# EAGLE board Raspberry_Pi_Circuit_Board (EAGLE 9.6.2), part 1 of 2
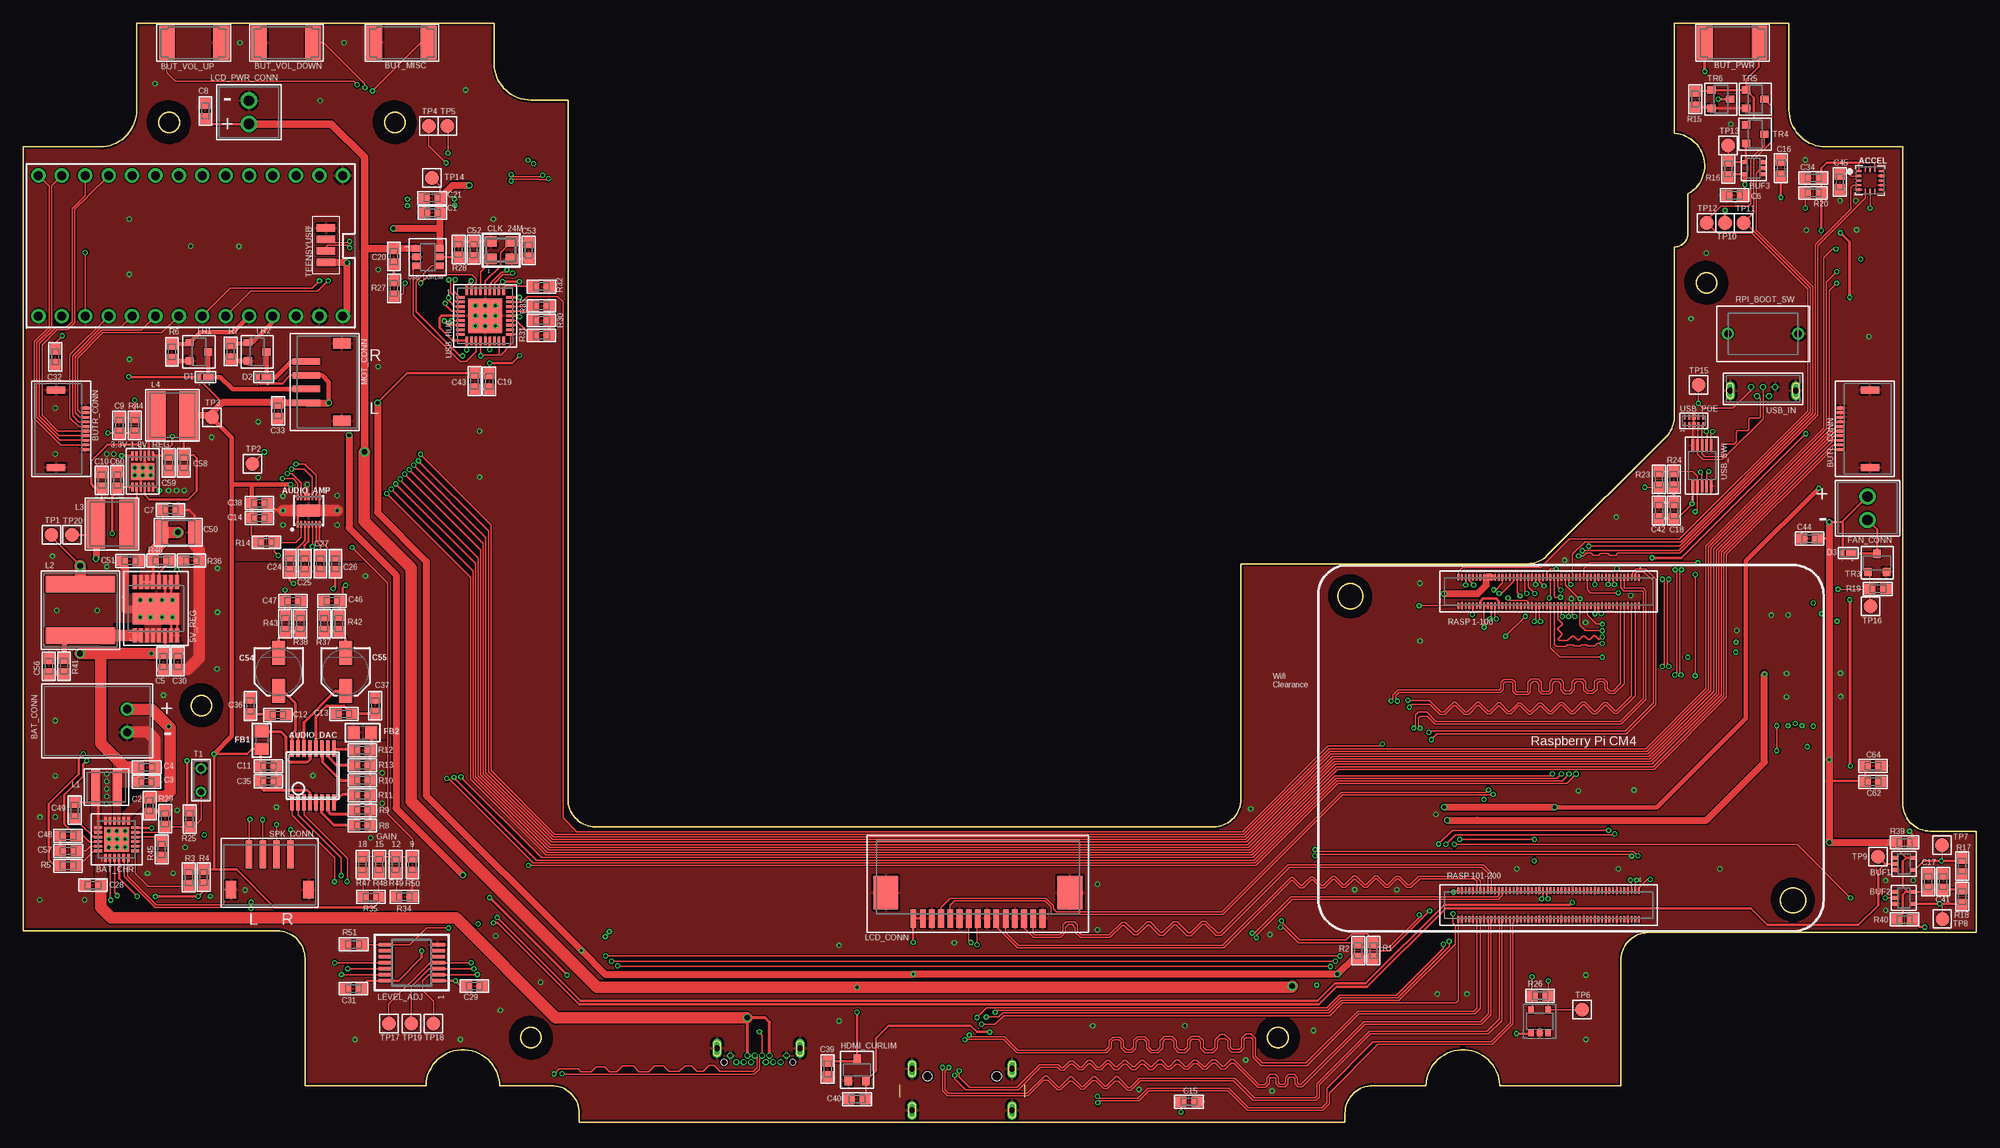
[diagram p15: board, top side]
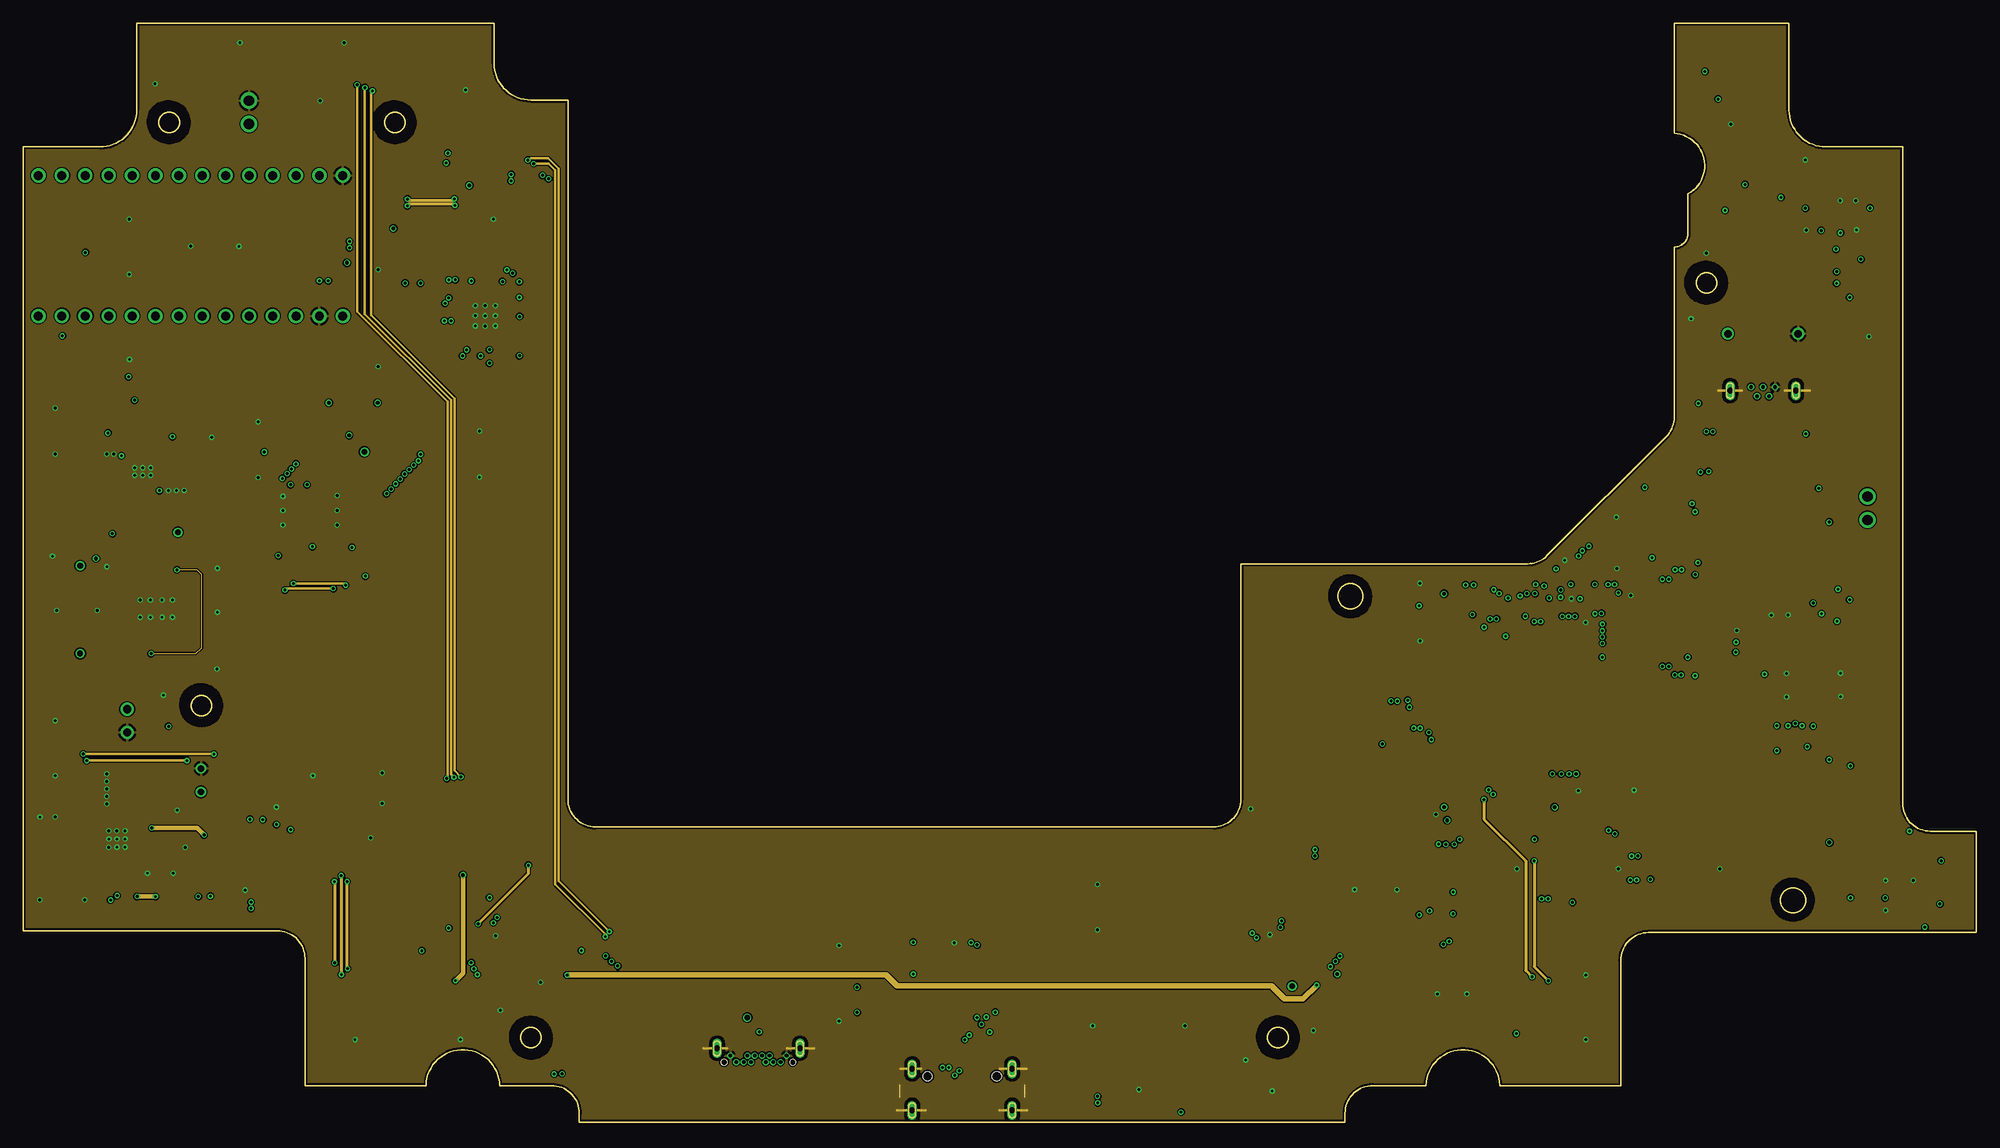
[diagram p16: board, inner layer Route2]
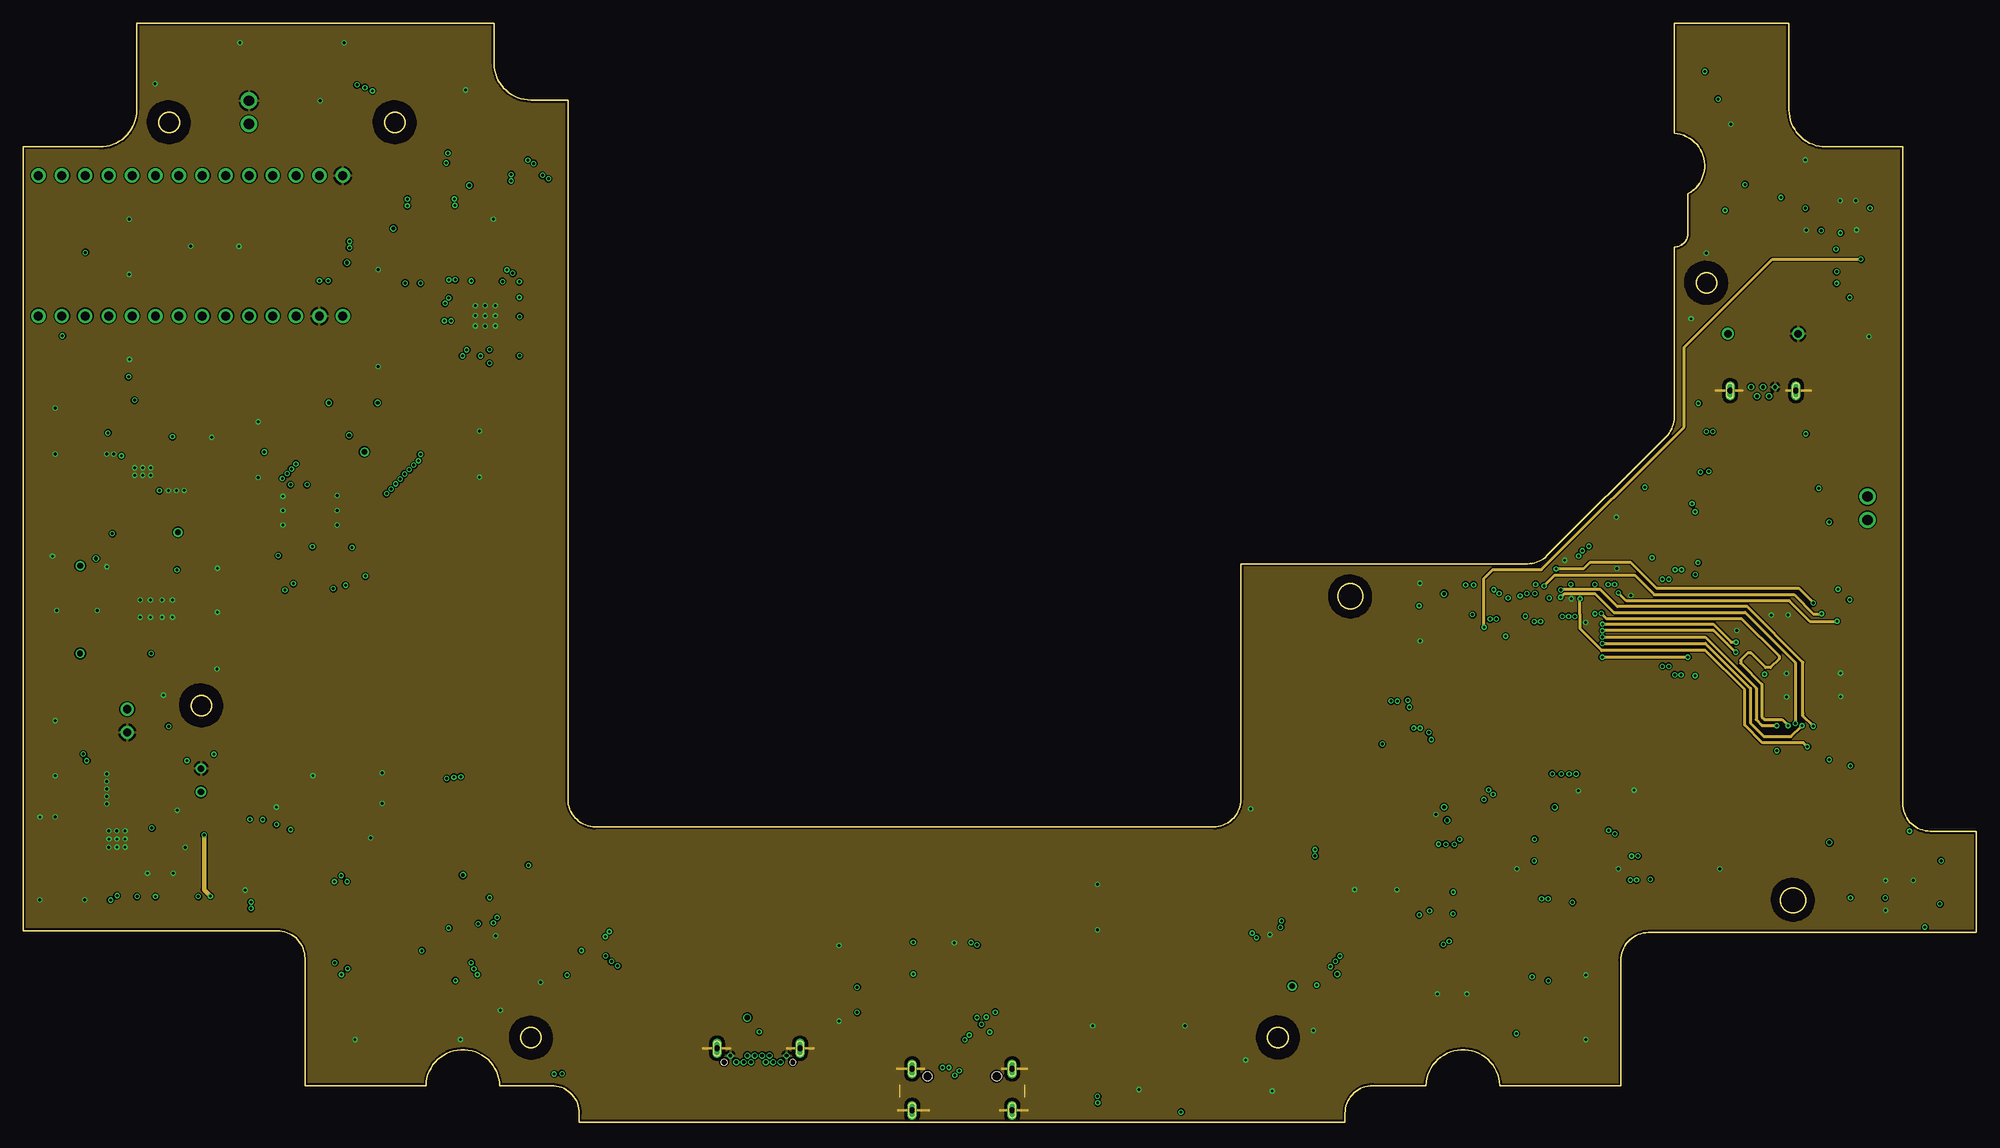
[diagram p17: board, inner layer Route15]
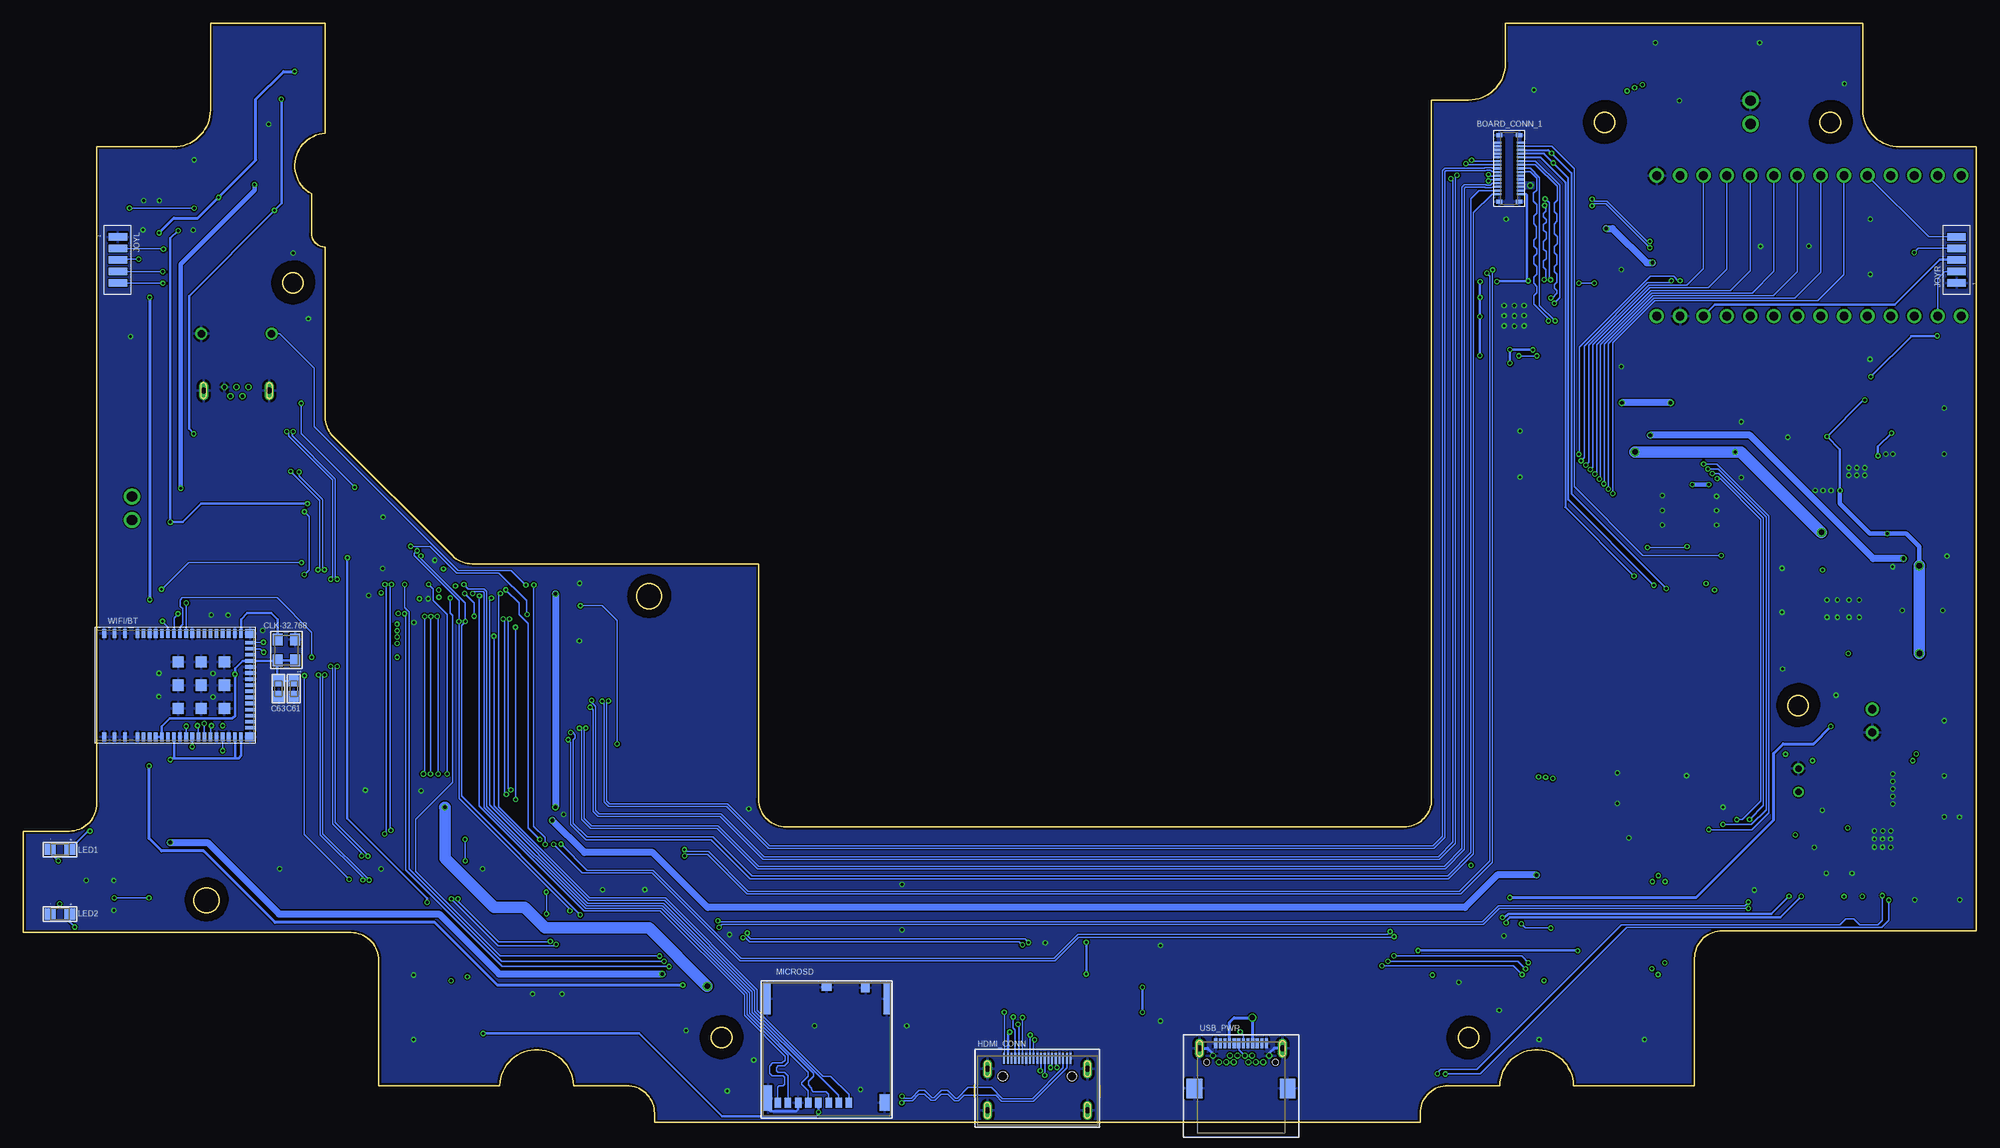
[diagram p18: board, bottom side, seen from below]

Size 211.85 x 119.26 mm. Coordinates in mm from the lower left corner, seen from the top.
Outline: 178.2,74.4 165.28,61.48 arc-45 163.15,60.6 132.09,60.6 132.09,35.07 arc-90 129.09,32.07 62.09,32.07 arc-90 59.09,35.07 59.09,110.9 55.08,110.9 arc-90 51.08,114.9 51.08,119.26 12.33,119.26 12.33,109.83 arc-90 8.33,105.83 0,105.83 0,20.8 27.57,20.8 arc-90 30.57,17.8 30.57,4 43.7,4 arc-177 51.69,4 57.33,4 arc-90 60.33,1 60.33,0 143.38,0 143.38,1 arc-90 146.38,4 152.16,4 arc-177 160.15,4 173.28,4 173.28,17.6 arc-90 176.28,20.6 211.85,20.6 211.85,31.6 206.85,31.6 arc-90 203.85,34.6 203.85,105.83 195.53,105.83 arc-90 191.53,109.83 191.53,119.26 179.08,119.26 179.08,107.29 arc-148 180.58,100.74 180.58,96.46 arc-90 179.08,94.96 179.08,76.52 arc-45 178.2,74.4
Outline: circle at 182.57,91.07 radius 1.1
Outline: circle at 143.95,57.1 radius 1.35
Outline: circle at 55.09,9.23 radius 1.1
Outline: circle at 136.09,9.23 radius 1.1
Outline: circle at 191.95,24.1 radius 1.35
Outline: circle at 40.34,108.47 radius 1.1
Outline: circle at 19.35,45.22 radius 1.1
Outline: circle at 15.86,108.47 radius 1.1
Copper layers (1+2*15+16): Top 0.035mm / dielectric 1.6mm / Route2 0.035mm / dielectric 0.15mm / Route15 0.035mm / dielectric 0.2mm / Bottom 0.035mm
Design rules "default2 *": minimum track width 5mil, minimum drill 0.3mm, track to track 5mil, track to pad 5mil, pad to pad 5mil, via to via 5mil, smd to smd 5mil, copper to edge 0.2mm, drill to drill 6mil, minimum pad ring 0.13mm, minimum via ring 0.13mm, stop-mask expansion 4mil, vias tented up to drill 0mil, thermal gap 10mil
Net classes: 1 PWR 1A: width 0.254 mm; 2 PWR 2A: width 0.762 mm; 3 PWR 3A: width 1.27 mm; 4 PWR 4A: width 2.032 mm
Milling: 50 lines

## Footprints (pad centres in the part's own frame; a part is rotated, then mirrored left to right if it is on the bottom)
IC-PAM2306 = smd 1 x 0.25: EN1 -1.7,-1.125; EN2 1.7,1.125; FB1 -1.7,-0.225; FB2 1.7,0.225; GND1 -1.7,0.225; GND2 1.7,-0.225; LX1 1.7,-0.675; LX2 -1.7,0.675; NC1 -1.7,-0.675; NC2 1.7,0.675; VIN1 1.7,-1.125; VIN2 -1.7,1.125 | smd 1.7 x 2.5: PWRPAD 0,0
IC-TPS61032 = smd 1.5 x 0.45: EN 2.875,-2.275; FB 2.875,-0.325; GND 2.875,-0.975; LBI -2.925,-1.625; LBO 2.875,-1.625; NC 2.875,2.275; PGND1 -2.925,0.975; PGND2 -2.925,0.325; PGND3 -2.925,-0.325; SW1 -2.925,2.275; SW2 -2.925,1.625; SYNC -2.925,-2.275; VBAT -2.925,-0.975; VOUT1 2.875,1.625; VOUT2 2.875,0.975; VOUT3 2.875,0.325 | smd 3.4 x 5: PWRPAD 0,0
MMA845X_QFN_16MM = smd 0.65 x 0.25: 1 -1.216,1; 2 -1.216,0.5; 3 -1.216,0; 4 -1.216,-0.5; 5 -1.216,-1; 9 1.216,-1; 10 1.216,-0.5; 11 1.216,0; 12 1.216,0.5; 13 1.216,1 | smd 0.25 x 0.65: 6 -0.5,-1.216; 7 0,-1.216; 8 0.5,-1.216; 14 0.5,1.216; 15 0,1.216; 16 -0.5,1.216
TDFN14_3X3MM = smd 0.7 x 0.2: P$1 -1.475,1.2; P$2 -1.475,0.8; P$3 -1.475,0.4; P$4 -1.475,0; P$5 -1.475,-0.4; P$6 -1.475,-0.8; P$7 -1.475,-1.2; P$8 1.475,-1.2; P$9 1.475,-0.8; P$10 1.475,-0.4; P$11 1.475,0; P$12 1.475,0.4; P$13 1.475,0.8; P$14 1.475,1.2 | smd 1.27 x 2.35: P$THERMAL 0,0
SSOP16_4.4MM = smd 0.4 x 1.75: 1 -2.275,-2.92; 2 -1.625,-2.92; 3 -0.975,-2.92; 4 -0.325,-2.92; 5 0.325,-2.92; 6 0.975,-2.92; 7 1.625,-2.92; 8 2.275,-2.92; 9 2.275,2.92; 10 1.625,2.92; 11 0.975,2.92; 12 0.325,2.92; 13 -0.325,2.92; 14 -0.975,2.92; 15 -1.625,2.92; 16 -2.275,2.92
IC-BQ25895 = smd 0.28 x 0.85: /CE -0.25,-2; /QON 1.25,-2; BTST 0.25,2; DSEL -1.25,2; ILIM 0.25,-2; INT -1.25,-2; OTG -0.75,-2; PMID -0.75,2; REGN -0.25,2; SW1 1.25,2; SW2 0.75,2; TS 0.75,-2 | smd 0.85 x 0.28: BAT1 2,-1.25; BAT2 2,-0.75; D+ -2,0.75; D- -2,0.25; PGND1 2,0.75; PGND2 2,1.25; SCL -2,-0.75; SDA -2,-1.25; STAT -2,-0.25; SYS1 2,-0.25; SYS2 2,0.25; VBUS -2,1.25 | smd 2.7 x 2.7: PWRPAD 0,0
CONN-S2B-XH-A = drill 0.9: 1 1.25,0; 2 -1.25,0
MEZZANINE-AXT630124 = smd 0.23 x 0.75: 1 2.8,1.225; 2 2.4,1.225; 3 2,1.225; 4 1.6,1.225; 5 1.2,1.225; 6 0.8,1.225; 7 0.4,1.225; 8 0,1.225; 9 -0.4,1.225; 10 -0.8,1.225; 11 -1.2,1.225; 12 -1.6,1.225; 13 -2,1.225; 14 -2.4,1.225; 15 -2.8,1.225; 16 2.8,-1.225; 17 2.4,-1.225; 18 2,-1.225; 19 1.6,-1.225; 20 1.2,-1.225; 21 0.8,-1.225; 22 0.4,-1.225; 23 0,-1.225; 24 -0.4,-1.225; 25 -0.8,-1.225; 26 -1.2,-1.225; 27 -1.6,-1.225; 28 -2,-1.225; 29 -2.4,-1.225; 30 -2.8,-1.225 | smd 0.45 x 0.655: MP_1 -3.6,1.077; MP_2 3.6,1.077; MP_3 -3.6,-1.077; MP_4 3.6,-1.077
BUF-74LVC1G07 = smd 0.42 x 0.6: A 0,-0.95; GND 0.65,-0.95; NC -0.65,-0.95; VCC -0.65,0.95; Y 0.65,0.95
BUT-KSS331GLFS = smd 1.7 x 3.7: 1 0,0; 2 5.9,0
CONN-FH52-10S-0.5SH = smd 0.3 x 0.85: 1 -2.25,0; 2 -1.75,0; 3 -1.25,0; 4 -0.75,0; 5 -0.25,0; 6 0.25,0; 7 0.75,0; 8 1.25,0; 9 1.75,0; 10 2.25,0 | smd 0.8 x 2: MP1 -4.2,-3.175; MP2 4.2,-3.175
CAP-603 = smd 1.2 x 1.1: A -0.85,0; C 0.85,0
CAP-TAN-1411 = smd 1.35 x 2.7: A -1.75,0; C 1.75,0
PANASONIC_C = smd 2.6 x 1.4: + 2.05,0; - -2.05,0
CLK-ECS-327 = smd 1.3 x 1.1: GND -1.15,0.95; OE 1.15,0.95; OUT -1.15,-0.95; VDD 1.15,-0.95
CLK-ECS-240 = smd 1.3 x 1.1: GND_1 -1.15,0.95; GND_2 1.15,-0.95; IN/OUT -1.15,-0.95; OUT/IN 1.15,0.95
DIODE-X3-WLB1608-2 = smd 1.035 x 0.69: A 0.293,0 | smd 0.385 x 0.69: C -0.619,0
CONN-282834-2 = drill 1.1: 1 -1.27,0; 2 1.27,0
0805@1 = smd 1.3 x 1.5: 1 -0.95,0; 2 0.95,0
HDMI-2001-1-2-21-00-BK = smd 0.23 x 1.2: 1 3.6,0; 2 3.2,0; 3 2.8,0; 4 2.4,0; 5 2,0; 6 1.6,0; 7 1.2,0; 8 0.8,0; 9 0.4,0; 10 0,0; 11 -0.4,0; 12 -0.8,0; 13 -1.2,0; 14 -1.6,0; 15 -2,0; 16 -2.4,0; 17 -2.8,0; 18 -3.2,0; 19 -3.6,0 | drill 0.65 long: MP_1 -5.425,-1.15; MP_2 -5.425,-5.65; MP_3 5.425,-1.15; MP_4 5.425,-5.65 | hole 1: -3.745,-1.95; 3.745,-1.95
CURLIM-AP2331 = smd 0.8 x 1: GND -0.954,-1.2; IN 0,1.2; OUT 0.954,-1.2
CONN_5PIN = smd 0.8 x 2: 1 -2.5,-1.29; 2 -1.25,-1.29; 3 0,-1.29; 4 1.25,-1.29; 5 2.5,-1.29
IND-74438357022 = smd 0.98 x 3.7: A -1.185,0; C 1.185,0
IND-NRS8040T6R8NJGJ = smd 1.8 x 7.5: A -2.8,0; C 2.8,0
IND-744043004 = smd 5.3 x 2: A 0,1.75; C 0,-1.75
FPC-1-84952-5 = smd 0.61 x 2: 1 7,1; 2 6,1; 3 5,1; 4 4,1; 5 3,1; 6 2,1; 7 1,1; 8 0,1; 9 -1,1; 10 -2,1; 11 -3,1; 12 -4,1; 13 -5,1; 14 -6,1; 15 -7,1 | smd 2.68 x 3.6: MP_1 -9.99,-1.8; MP_2 9.99,-1.8
LED-SM0805UWC = smd 1.2 x 1.2: A 0,1.05; C 0,-1.05
IC-TXB0104 = smd 0.35 x 1.6: A1 -1.3,-2.8; A2 -0.65,-2.8; A3 0,-2.8; A4 0.65,-2.8; B1 -1.3,2.8; B2 -0.65,2.8; B3 0,2.8; B4 0.65,2.8; GND 1.95,-2.8; NC1 1.3,-2.8; NC2 1.3,2.8; OE 1.95,2.8; VCCA -1.95,-2.8; VCCB -1.95,2.8
MICROSD-5033981892_SD = smd 0.7 x 1.1: CLK 4.4,0; CMD 2.2,0; DAT0 6.6,0; DAT1 7.7,0; DAT2 0,0; DAT3 1.1,0; VDD 3.3,0; VSS 5.5,0 | smd 0.9 x 0.93: DL -1.79,-12.45 | smd 1.05 x 0.78: DS 2.425,-12.54 | smd 1.14 x 1.8: MP_1 -3.88,0 | smd 0.86 x 2.8: MP_2 8.78,-0.5 | smd 0.7 x 3.33: MP_3 -4.1,-11.265; MP_4 8.86,-11.265
IC-RT9742 = smd 0.6 x 0.8: /FLG 0.94,-1.25; EN 0.94,1.196; GND 0,-1.25; VIN -0.94,1.196; VOUT -0.94,-1.25
CONN-VS4B-ZR-SM4A-TF = smd 0.7 x 3: 1 2.25,-1.5; 2 0.75,-1.5; 3 -0.75,-1.5; 4 -2.25,-1.5 | smd 1.1 x 1.9: MP_1 4.2,2.35; MP_2 -4.2,2.35
RES-603 = smd 1.2 x 1.1: A -0.85,0; C 0.85,0
DIP-A6TN-1104 = drill 0.8: 1 0,3.81; 2 0,-3.81
CONN-DF40_CL0594-5437-8-00_2D = smd 0.2 x 0.7: 1 9.8,1.54; 2 9.8,-1.54; 3 9.4,1.54; 4 9.4,-1.54; 5 9,1.54; 6 9,-1.54; 7 8.6,1.54; 8 8.6,-1.54; 9 8.2,1.54; 10 8.2,-1.54; 11 7.8,1.54; 12 7.8,-1.54; 13 7.4,1.54; 14 7.4,-1.54; 15 7,1.54; 16 7,-1.54; 17 6.6,1.54; 18 6.6,-1.54; 19 6.2,1.54; 20 6.2,-1.54; 21 5.8,1.54; 22 5.8,-1.54; 23 5.4,1.54; 24 5.4,-1.54; 25 5,1.54; 26 5,-1.54; 27 4.6,1.54; 28 4.6,-1.54; 29 4.2,1.54; 30 4.2,-1.54; 31 3.8,1.54; 32 3.8,-1.54; 33 3.4,1.54; 34 3.4,-1.54; 35 3,1.54; 36 3,-1.54; 37 2.6,1.54; 38 2.6,-1.54; 39 2.2,1.54; 40 2.2,-1.54; 41 1.8,1.54; 42 1.8,-1.54; 43 1.4,1.54; 44 1.4,-1.54; 45 1,1.54; 46 1,-1.54; 47 0.6,1.54; 48 0.6,-1.54; 49 0.2,1.54; 50 0.2,-1.54; 51 -0.2,1.54; 52 -0.2,-1.54; 53 -0.6,1.54; 54 -0.6,-1.54; 55 -1,1.54; 56 -1,-1.54; 57 -1.4,1.54; 58 -1.4,-1.54; 59 -1.8,1.54; 60 -1.8,-1.54; 61 -2.2,1.54; 62 -2.2,-1.54; 63 -2.6,1.54; 64 -2.6,-1.54; 65 -3,1.54; 66 -3,-1.54; 67 -3.4,1.54; 68 -3.4,-1.54; 69 -3.8,1.54; 70 -3.8,-1.54; 71 -4.2,1.54; 72 -4.2,-1.54; 73 -4.6,1.54; 74 -4.6,-1.54; 75 -5,1.54; 76 -5,-1.54; 77 -5.4,1.54; 78 -5.4,-1.54; 79 -5.8,1.54; 80 -5.8,-1.54; 81 -6.2,1.54; 82 -6.2,-1.54; 83 -6.6,1.54; 84 -6.6,-1.54; 85 -7,1.54; 86 -7,-1.54; 87 -7.4,1.54; 88 -7.4,-1.54; 89 -7.8,1.54; 90 -7.8,-1.54; 91 -8.2,1.54; 92 -8.2,-1.54; 93 -8.6,1.54; 94 -8.6,-1.54; 95 -9,1.54; 96 -9,-1.54; 97 -9.4,1.54; 98 -9.4,-1.54; 99 -9.8,1.54; 100 -9.8,-1.54
THERM-NTCLE101E3C90173 = drill 0.7: 1 -1.27,0; 2 1.27,0
TEENSY_3.0-3.2&LC_DIL = drill 0.965: 0 -7.62,13.97; 1 -7.62,11.43; 2 -7.62,8.89; 3 -7.62,6.35; 3.3V 7.62,11.43; 4 -7.62,3.81; 5 -7.62,1.27; 6 -7.62,-1.27; 7 -7.62,-3.81; 8 -7.62,-6.35; 9 -7.62,-8.89; 10 -7.62,-11.43; 11 -7.62,-13.97; 12 -7.62,-16.51; 13 7.62,-16.51; 14/A0 7.62,-13.97; 15/A1 7.62,-11.43; 16/A2 7.62,-8.89; 17/A3 7.62,-6.35; 18/A4 7.62,-3.81; 19/A5 7.62,-1.27; 20/A6 7.62,1.27; 21/A7 7.62,3.81; 22/A8 7.62,6.35; 23/A9 7.62,8.89; AGND 7.62,13.97; GND -7.62,16.51; VIN 7.62,16.51
CONN_4PIN = smd 0.8 x 2: 1 -2.5,-1.29; 2 -1.25,-1.29; 3 0,-1.29; 4 1.25,-1.29
TESTPOINT = smd 1.5 x 1.5: TP 0,0
TRAN-DMG2302UKQ = smd 0.8 x 0.9: D 0,1; G -1,-1; S 1,-1
CURLIM-AP22653W6 = smd 0.7 x 0.9: EN 0.95,-1.25; GND 0,-1.25; ILIM 0,1.25; IN -0.95,-1.25; NFAULT 0.95,1.25; OUT -0.95,1.25
USBPORT-USB2514BT-I/M2 = smd 0.9 x 0.28: 1 -2.7,2; 2 -2.7,1.5; 3 -2.7,1; 4 -2.7,0.5; 5 -2.7,0; 6 -2.7,-0.5; 7 -2.7,-1; 8 -2.7,-1.5; 9 -2.7,-2; 19 2.7,-2; 20 2.7,-1.5; 21 2.7,-1; 22 2.7,-0.5; 23 2.7,0; 24 2.7,0.5; 25 2.7,1; 26 2.7,1.5; 27 2.7,2 | smd 0.28 x 0.9: 10 -2,-2.7; 11 -1.5,-2.7; 12 -1,-2.7; 13 -0.5,-2.7; 14 0,-2.7; 15 0.5,-2.7; 16 1,-2.7; 17 1.5,-2.7; 18 2,-2.7; 28 2,2.7; 29 1.5,2.7; 30 1,2.7; 31 0.5,2.7; 32 0,2.7; 33 -0.5,2.7; 34 -1,2.7; 35 -1.5,2.7; 36 -2,2.7 | smd 3.7 x 3.7: 37 0,0
USB-USB3131-30-0230-A = drill 0.4: D+ 0,0; D- -0.65,-1; GND 1.3,0; NC 0.65,-1; VBUS -1.3,0 | drill 0.65 long: MP_1 -3.575,-0.395; MP_2 3.575,-0.395
POE_PROT-TPD4EUSB30DQAR = smd 0.565 x 0.2: D1+ -0.417,1; D1- -0.417,0.5; D2+ -0.417,-0.5; D2- -0.417,-1; NC_1 0.417,1; NC_2 0.417,0.5; NC_3 0.417,-0.5; NC_4 0.417,-1 | smd 0.565 x 0.4: GND_1 -0.417,0; GND_2 0.417,0
USBC-USB-C31-S-RA-CS1D-BK-T/R = smd 0.35 x 1.1: CC1 -0.75,1.35; D+ -0.25,1.35; D- 0.25,1.35; GND_1 -2.75,1.35; GND_2 2.75,1.35; RX2+ 2.25,1.35; RX2- 1.75,1.35; SBU1 0.75,1.35; TX1+ -2.25,1.35; TX1- -1.75,1.35; VBUS_1 -1.25,1.35; VBUS_2 1.25,1.35 | drill 0.4 pad 0.65: CC2 0.8,-0.7; D+_2 0.4,0; D-_2 -0.4,0; GND_3 3.05,0; GND_4 -3.05,0; RX1+ -2.4,-0.7; RX1- -1.6,-0.7; SBU2 -0.8,-0.7; TX2+ 2.4,-0.7; TX2- 1.6,-0.7; VBUS_3 1.2,0; VBUS_4 -1.2,0 | smd 1.7 x 2.1: MP_1 -5.05,-3.55; MP_2 5.05,-3.55 | drill 0.65 long: MP_3 4.5,0.8; MP_4 -4.5,0.8 | hole 0.65: -3.725,-0.7; 3.725,-0.7
USB_SWITCH-FSUSB42-D = smd 0.3 x 1.4: /OE -1,2.2; D+ 0,-2.2; D- 0.5,-2.2; GND 1,-2.2; HSD1+ 0.5,2.2; HSD1- 1,2.2; HSD2+ -0.5,2.2; HSD2- 0,2.2; SEL -0.5,-2.2; VCC -1,-2.2
IC-LWB5+ = smd 1 x 0.4: 1 -5.6,6.93; 2 -5.6,6.27; 3 -5.6,5.61; 4 -5.6,4.95; 5 -5.6,4.29; 6 -5.6,3.63; 7 -5.6,2.97; 8 -5.6,2.31; 9 -5.6,1.65; 10 -5.6,0.99; 11 -5.6,0.33; 12 -5.6,-0.33; 13 -5.6,-0.99; 14 -5.6,-1.65; 15 -5.6,-2.31; 16 -5.6,-2.97; 17 -5.6,-3.63; 18 -5.6,-4.29; 34 5.6,-4.29; 35 5.6,-3.63; 36 5.6,-2.97; 37 5.6,-2.31; 38 5.6,-1.65; 39 5.6,-0.99; 40 5.6,-0.33; 41 5.6,0.33; 42 5.6,0.99; 43 5.6,1.65; 44 5.6,2.31; 45 5.6,2.97; 46 5.6,3.63; 47 5.6,4.29; 48 5.6,4.95; 49 5.6,5.61; 50 5.6,6.27; 51 5.6,6.93; G3 5.62,8.28; G4 5.62,9.41; G5 5.62,10.54; G6 -5.6,10.54; G7 -5.6,9.41; G8 -5.6,8.28 | smd 0.4 x 1: 19 -4.62,-5.27; 20 -3.96,-5.27; 21 -3.3,-5.27; 22 -2.64,-5.27; 23 -1.98,-5.27; 24 -1.32,-5.27; 25 -0.66,-5.27; 26 0,-5.27; 27 0.66,-5.27; 28 1.32,-5.27; 29 1.98,-5.27; 30 2.64,-5.27; 31 3.3,-5.27; 32 3.96,-5.27; 33 4.62,-5.27 | smd 1 x 1: G1 -5.6,-5.27; G2 5.6,-5.27 | smd 1.2 x 1.2: G9 2.5,2.5; G10 2.5,0; G11 2.5,-2.5; G12 0,2.5; G13 0,0; G14 0,-2.5; G15 -2.5,2.5; G16 -2.5,0; G17 -2.5,-2.5

## Placement (x,y rotation side)
3.3V-1.8V_REG  IC-PAM2306  [IC-PAM2306]  12.98,70.62 90 top
5V_REG  IC-TP61032  [IC-TPS61032]  14.42,55.75 90 top
ACCEL  MMA8451  [MMA845X_QFN_16MM]  200.31,102.18 0 top
AUDIO_AMP  MAX98306ETD+T  [TDFN14_3X3MM]  30.98,66.38 90 top
AUDIO_DAC  UDA1334ATS  [SSOP16_4.4MM]  31.44,37.62 0 top
BAT_CHR  IC-BQ25895  [IC-BQ25895]  10.17,30.72 90 top
BAT_CONN  CONN-S2B-XH-A  [CONN-S2B-XH-A]  11.29,43.57 90 top
BOARD_CONN_1  MEZZANINE-AXT630124  [MEZZANINE-AXT630124]  50.67,103.49 270 bottom
BUF1  BUF-74LVC1G07  [BUF-74LVC1G07]  203.99,28.05 270 top
BUF2  BUF-74LVC1G07  [BUF-74LVC1G07]  203.97,24.36 270 top
BUF3  BUF-74LVC1G07  [BUF-74LVC1G07]  187.69,103.52 90 top
BUT_MISC  BUT-KSS331GLFS  [BUT-KSS331GLFS]  38.08,117.13 0 top
BUT_PWR  BUT-KSS331GLFS  [BUT-KSS331GLFS]  182.41,117.13 0 top
BUT_VOL_DOWN  BUT-KSS331GLFS  [BUT-KSS331GLFS]  25.57,117.13 0 top
BUT_VOL_UP  BUT-KSS331GLFS  [BUT-KSS331GLFS]  21.49,117.13 180 top
BUTL_CONN  CONN-FH52-10S-0.5SH  [CONN-FH52-10S-0.5SH]  197.12,75.25 90 top
BUTR_CONN  CONN-FH52-10S-0.5SH  [CONN-FH52-10S-0.5SH]  6.75,75.25 270 top
C1  100uF  [CAP-603]  44.38,98.68 0 top
C2  10uF  [CAP-603]  13.73,34.38 90 top
C3  10uF  [CAP-603]  13.4,36.93 180 top
C4  10uF  [CAP-603]  13.41,38.53 180 top
C5  10uF  [CAP-603]  15.22,50.01 90 top
C6  10uF  [CAP-603]  185.6,100.57 0 top
C7  10uF  [CAP-603]  15.98,66.46 180 top
C8  10uF  [CAP-603]  19.78,109.72 270 top
C9  10uF  [CAP-603]  10.45,75.62 270 top
C10  10uF  [CAP-603]  8.55,69.68 270 top
C11  10uF  [CAP-603]  26.62,38.62 180 top
C12  10uF  [CAP-603]  27.62,44.2 180 top
C13  10uF  [CAP-603]  34.8,44.31 0 top
C14  10uF  [CAP-603]  25.62,65.56 180 top
C15  10uF  [CAP-603]  126.44,2.25 180 top
C16  10uF  [CAP-603]  190.64,103.52 270 top
C17  10uF  [CAP-603]  206.61,26.14 270 top
C18  10uF  [CAP-603]  179.04,66.39 270 top
C19  10uF  [CAP-603]  50.55,80.41 90 top
C20  10uF  [CAP-603]  40.22,93.93 90 top
C21  10uF  [CAP-603]  44.37,100.28 0 top
C24  1uF  [CAP-603]  28.94,60.62 90 top
C25  1uF  [CAP-603]  30.56,60.62 90 top
C26  1uF  [CAP-603]  33.88,60.62 90 top
C27  1uF  [CAP-603]  32.25,60.62 90 top
C28  1uF  [CAP-603]  7.59,25.75 0 top
C29  0.1uF  [CAP-603]  48.94,14.8 0 top
C30  0.1uF  [CAP-603]  16.78,50.01 90 top
C31  0.1uF  [CAP-603]  35.83,14.52 180 top
C32  0.1uF  [CAP-603]  3.49,83.06 90 top
C33  0.1uF  [CAP-603]  27.65,77.21 90 top
C34  0.1uF  [CAP-603]  194.16,102.46 0 top
C35  0.1uF  [CAP-603]  26.62,37 180 top
C36  0.1uF  [CAP-603]  24.66,45.19 270 top
C37  0.1uF  [CAP-603]  38.2,45.21 270 top
C38  0.1uF  [CAP-603]  25.62,67.19 180 top
C39  0.1uF  [CAP-603]  87.27,5.78 90 top
C40  0.1uF  [CAP-603]  90.44,2.53 0 top
C41  0.1uF  [CAP-603]  208.23,26.13 270 top
C42  0.1uF  [CAP-603]  177.42,66.38 270 top
C43  0.1uF  [CAP-603]  48.97,80.42 90 top
C44  0.1uF  [CAP-603]  193.74,63.33 0 top
C45  0.1uF  [CAP-603]  197.04,102.03 90 top
C46  0.01uF  [CAP-603]  33.5,56.56 0 top
C47  0.01uF  [CAP-603]  29.25,56.56 180 top
C48  4.7uF  [CAP-603]  4.89,31.11 0 top
C49  47nF  [CAP-603]  5.6,33.86 90 top
C50  220uF  [CAP-TAN-1411]  16.83,64.01 0 top
C51  2.2uF  [CAP-603]  11.62,60.92 0 top
C52  27pF  [CAP-603]  48.87,94.68 270 top
C53  27pF  [CAP-603]  54.84,94.62 90 top
C54  47uF  [PANASONIC_C]  27.74,48.88 270 top
C55  47uF  [PANASONIC_C]  34.97,48.88 270 top
C56  0.1uF  [CAP-603]  2.81,49.51 90 top
C57  8.2uF  [CAP-603]  4.9,29.47 180 top
C58  10uF  [CAP-603]  17.44,71.55 90 top
C59  4.7uF  [CAP-603]  15.81,71.55 90 top
C60  4.7uF  [CAP-603]  10.21,69.69 270 top
C61  0.1uF  [CAP-603]  182.49,47.05 90 bottom
C62  0.1uF  [CAP-603]  200.65,36.95 180 top
C63  10uF  [CAP-603]  184.15,47.04 90 bottom
C64  10uF  [CAP-603]  200.65,38.67 180 top
CLK-32.768  CLK-ECS-327  [CLK-ECS-327]  183.29,51.24 270 bottom
CLK_24M  CLK-ECS-240  [CLK-ECS-240]  51.84,94.63 0 top
D1  [DIODE-X3-WLB1608-2]  19.77,80.85 0 top
D2  [DIODE-X3-WLB1608-2]  26.1,80.85 0 top
D3  [DIODE-X3-WLB1608-2]  197.96,61.77 0 top
FAN_CONN  CONN-282834-2  [CONN-282834-2]  200.04,66.63 270 top
FB1  Ferrite  [0805@1]  25.88,41.46 270 top
FB2  Ferrite  [0805@1]  36.81,42.29 0 top
HDMI_CONN  HDMI-2001-1-2-21-00-BK  [HDMI-2001-1-2-21-00-BK]  101.85,6.97 0 bottom
HDMI_CURLIM  CURLIM-AP2331  [CURLIM-AP2331]  90.45,5.72 0 top
JOYL  CONN_5PIN  [CONN_5PIN]  200.28,93.56 270 bottom
JOYR  CONN_5PIN  [CONN_5PIN]  3.44,93.57 90 bottom
L1  IND-74438357022  [IND-74438357022]  9.04,36.38 0 top
L2  IND-NRS8040T6R8NJGJ  [IND-NRS8040T6R8NJGJ]  6.23,55.58 270 top
L3  IND-744043004  [IND-744043004]  9.66,64.92 270 top
L4  IND-744043004  [IND-744043004]  16.21,76.7 90 top
LCD_CONN  FPC-1-84952-5  [FPC-1-84952-5]  103.56,23.13 180 top
LCD_PWR_CONN  CONN-282834-2  [CONN-282834-2]  24.5,109.58 90 top
LED1  LED-SM0805UWC  [LED-SM0805UWC]  207.85,29.61 270 bottom
LED2  LED-SM0805UWC  [LED-SM0805UWC]  207.85,22.61 270 bottom
LEVEL_ADJ  IC-TXB0104  [IC-TXB0104]  42.15,17.34 90 top
MICROSD  MICROSD-5033981892_SD  [MICROSD-5033981892_SD]  122.29,2.15 180 bottom
MICROSD_SWI  IC-RT9742  [IC-RT9742]  164.48,11 0 top
MOT_CONN  [CONN-VS4B-ZR-SM4A-TF]  32.22,80.31 270 top
R1  10K  [RES-603]  146.45,18.64 90 top
R2  10K  [RES-603]  144.81,18.64 90 top
R3  10K  [RES-603]  17.98,26.59 270 top
R4  10K  [RES-603]  19.58,26.6 270 top
R5  10K  [RES-603]  4.88,27.86 0 top
R6  10K  [RES-603]  16.15,83.6 90 top
R7  10K  [RES-603]  22.52,83.67 90 top
R8  10K  [RES-603]  36.81,32.25 180 top
R9  10K  [RES-603]  36.81,33.88 180 top
R10  10K  [RES-603]  36.81,37.12 180 top
R11  10K  [RES-603]  36.81,35.5 180 top
R12  10K  [RES-603]  36.81,40.38 180 top
R13  10K  [RES-603]  36.81,38.75 180 top
R14  10K  [RES-603]  26.38,62.94 180 top
R15  10K  [RES-603]  181.37,111 90 top
R16  10K  [RES-603]  184.94,103.42 270 top
R17  10K  [RES-603]  210.3,27.8 270 top
R18  10K  [RES-603]  210.3,24.5 90 top
R19  10K  [RES-603]  201.15,57.89 180 top
R20  10K  [RES-603]  194.15,100.83 0 top
R23  2.2K  [RES-603]  177.41,69.75 90 top
R24  2.2K  [RES-603]  179.02,69.76 270 top
R25  5.23K  [RES-603]  18.06,32.93 90 top
R26  12K  [RES-603]  164.53,13.76 180 top
R27  12K  [RES-603]  40.24,90.47 90 top
R28  15K  [RES-603]  47.23,94.72 270 top
R29  30.1K  [RES-603]  15.4,32.94 270 top
R30  36K  [RES-603]  56.23,87.01 0 top
R31  36K  [RES-603]  56.23,85.39 0 top
R32  36K  [RES-603]  56.21,90.69 0 top
R33  36K  [RES-603]  56.22,88.58 0 top
R34  100K  [RES-603]  41.36,24.48 180 top
R35  100K  [RES-603]  37.72,24.47 0 top
R36  180K  [RES-603]  18.28,60.94 180 top
R37  220K  [RES-603]  32.65,54.12 270 top
R38  220K  [RES-603]  30.06,54.12 270 top
R39  2.2K  [RES-603]  204.04,30.38 180 top
R40  2.2K  [RES-603]  204.03,22.02 180 top
R41  47  [RES-603]  4.44,49.49 270 top
R42  100  [RES-603]  34.25,54.12 90 top
R43  100  [RES-603]  28.44,54.12 90 top
R44  100K  [RES-603]  12.12,75.63 270 top
R45  120  [RES-603]  15.02,29.63 90 top
R46  1.65M  [RES-603]  14.97,60.94 180 top
R47  0K  [RES-603]  36.82,27.99 270 top
R48  0K  [RES-603]  38.61,27.99 270 top
R49  0K  [RES-603]  40.41,27.99 270 top
R50  0K  [RES-603]  42.23,27.98 270 top
R51  50K  [RES-603]  35.86,19.3 0 top
RPI_BOOT_SW  DIP-A6TN-1104  [DIP-A6TN-1104]  188.71,85.56 90 top
RPI_PINS1-100  CONN-DF40_CL0594-5437-8-00_2D  [CONN-DF40_CL0594-5437-8-00_2D]  165.45,57.6 0 top
RPI_PINS101-200  CONN-DF40_CL0594-5437-8-00_2D  [CONN-DF40_CL0594-5437-8-00_2D]  165.45,23.6 0 top
SPK_CONN  [CONN-VS4B-ZR-SM4A-TF]  26.75,27.59 180 top
T1  10K  [THERM-NTCLE101E3C90173]  19.31,37.13 90 top
TEENSY  TEENSY_LC_DIL  [TEENSY_3.0-3.2&LC_DIL]  18.17,95.1 270 top
TEENSYUSB  CONN_4PIN  [CONN_4PIN]  34.15,94.54 270 top
TP1  TESTPOINT  [TESTPOINT]  3.1,63.74 0 top
TP2  TESTPOINT  [TESTPOINT]  24.9,71.47 0 top
TP3  TESTPOINT  [TESTPOINT]  20.47,76.48 0 top
TP4  TESTPOINT  [TESTPOINT]  44,108.1 0 top
TP5  TESTPOINT  [TESTPOINT]  46,108.1 0 top
TP6  TESTPOINT  [TESTPOINT]  169.07,12.24 0 top
TP7  TESTPOINT  [TESTPOINT]  208.12,30.11 0 top
TP8  TESTPOINT  [TESTPOINT]  208.15,22.09 0 top
TP9  TESTPOINT  [TESTPOINT]  201.18,28.82 0 top
TP10  TESTPOINT  [TESTPOINT]  184.6,97.6 0 top
TP11  TESTPOINT  [TESTPOINT]  186.6,97.6 0 top
TP12  TESTPOINT  [TESTPOINT]  182.6,97.6 0 top
TP13  TESTPOINT  [TESTPOINT]  184.9,106 0 top
TP14  TESTPOINT  [TESTPOINT]  44.34,102.45 0 top
TP15  TESTPOINT  [TESTPOINT]  181.71,80.02 0 top
TP16  TESTPOINT  [TESTPOINT]  200.36,55.99 0 top
TP17  TESTPOINT  [TESTPOINT]  39.67,10.72 0 top
TP18  TESTPOINT  [TESTPOINT]  44.52,10.72 0 top
TP19  TESTPOINT  [TESTPOINT]  42.11,10.72 0 top
TP20  TESTPOINT  [TESTPOINT]  5.32,63.73 0 top
TR1  [TRAN-DMG2302UKQ]  19.08,83.6 270 top
TR2  [TRAN-DMG2302UKQ]  25.4,83.6 270 top
TR3  [TRAN-DMG2302UKQ]  201.08,60.7 0 top
TR4  [TRAN-DMG2302UKQ]  187.85,107.2 270 top
TR5  [TRAN-DMG2302UKQ]  187.87,111 270 top
TR6  [TRAN-DMG2302UKQ]  184.12,111 270 top
USB_CURLIM  CURLIM-AP22653W6  [CURLIM-AP22653W6]  43.89,93.88 270 top
USB_HUB  USBPORT-USB2514BT-I/M2  [USBPORT-USB2514BT-I/M2]  50.12,87.5 0 top
USB_IN  USB-USB3131-30-0230-A  [USB-USB3131-30-0230-A]  188.71,79.78 0 top
USB_POE  POE_PROT-TPD4EUSB30DQAR  [POE_PROT-TPD4EUSB30DQAR]  181.19,76.11 90 top
USB_PWR  USBC-USB-C31-S-RA-CS1D-BK-T/R  [USBC-USB-C31-S-RA-CS1D-BK-T/R]  79.75,7.25 0 bottom
USB_SWI  USB_SWITCH-FSUSB42-D  [USB_SWITCH-FSUSB42-D]  182.08,71.25 0 top
WIFI/BT  IC-LWB5+  [IC-LWB5+]  192.51,47.43 90 bottom

## Tracks (layer width: path | path; a pad name or v marks a point on that pad's centre or on a via)
AGND  (via drill 0.3)
  Top 0.254: AUDIO_DAC.15 29.81,42.13
  Bottom 0.203: BOARD_CONN_1.11 47.3,104.69 44.59,101.99 44.59,66.74 v37.13,59.28
  pour Top: 23.02,60.65 37.22,60.65 39.49,58.38 39.49,41.74 39.4,41.66 23.08,41.66 23.04,41.69 23.04,60.61
AUDSD  (via drill 0.3)
  Top 0.152: AUDIO_AMP.P$2 30.18,63.53 29.58,62.93 R14.A | R14.A | v27.68,61.49 27.23,61.95 R14.A
  Bottom 0.152: BOARD_CONN_1.14 46.04,105.89 43.63,103.48 43.63,68.96 36.16,61.49 v27.68,61.49
BAT  (via drill 0.3)
  Top 0.254: C16.C v190.64,100.36 v190.65,100.35
  Top 0.305: v59,16 v50.6,24.4 | v198.1,56.7 198.19,56.62 v198.19,38.69 | v198.1,89.5 198.1,95.5 v197.1,96.5 | v182.4,114 BUT_PWR.1
  Top 1.27: C2.C 13.86,35.36 13.86,35.35 15.42,35.35 15.94,35.87 15.94,42.82 v15.79,42.97 13.93,44.82 BAT_CONN.1
  Route2 0.61: v59,16 93.6,16 94.8,14.8 135.4,14.8 136.8,13.4 138.8,13.4 v140.3,14.9
  Bottom 0.305: v15.79,42.97 17.67,41.09 20.96,41.09 22,40.05 22,32.8 30.4,24.4 v50.6,24.4 | v140.3,14.9 160.4,14.9 167.2,21.7 184.53,21.7 192.28,29.44 196.82,29.44 198.19,30.8 v198.19,38.69 | v198.1,89.5 v198.1,56.7 | v197.1,96.5 195.5,98.1 192.9,98.1 v190.65,100.35 186.6,104.4 186.6,111 183.6,114 v182.4,114
  pour Top (no thermals): 10.93,32.36 10.93,33.66 13.19,35.91 14.01,35.91 14.21,35.72 14.21,34.84 14.16,34.8 13.32,34.8 11.67,33.15 11.62,33.09 11.62,32.36
BITCLK_IN  (via drill 0.3)
  Top 0.152: RPI_PINS1-100.49 165.65,57.2 165.52,57.07 v165.52,56.89 | v142.81,18.05 v142.8,18.05 63.2,18.05 v63.18,18.07 | TP17.TP 39.67,12.87 44.14,17.34 LEVEL_ADJ.A3 v48.6,17.34
  Bottom 0.152: v142.81,18.05 v142.82,18.06 160.09,18.06 169.25,27.22 169.25,32.9 165.25,36.91 165.25,55.02 165.52,55.29 v165.52,56.89 | v63.18,18.07 63.17,18.05 49.31,18.05 v48.6,17.34
BT_REG_ON  (via drill 0.3)
  Top 0.152: RPI_PINS1-100.34 168.85,53.96 169.46,53.35 v171.29,53.35
  Route15 0.305: v171.29,53.35 183.34,53.35 185.68,51.02 v185.75,51.02
  Bottom 0.152: WIFI/BT.32 187.19,51.34 186.14,51.34 185.82,51.02 v185.75,51.02
BT_UART_CTS  (via drill 0.3)
  Top 0.152: RPI_PINS1-100.29 169.65,57.8 170,57.45 v173.01,57.45 v173.02,57.45
  Route15 0.305: v173.02,57.45 173.89,56.58 191.57,56.58 193.78,54.36 v196.73,54.36 v196.74,54.37
  Bottom 0.152: v196.74,54.37 196.14,53.77 WIFI/BT.46
BT_UART_RTS  (via drill 0.3)
  Top 0.152: RPI_PINS1-100.50 165.65,51.48 166.65,50.48 v171.27,50.48
  Route15 0.305: v171.27,50.48 v180.55,50.48
  Bottom 0.152: v180.55,50.48 180.55,53.18 184.3,56.93 194.56,56.93 194.79,56.7 194.79,55.99 194.55,55.76 194.55,54.02 194.82,53.76 WIFI/BT.44
BT_UART_RXD  (via drill 0.3)
  Top 0.152: RPI_PINS1-100.51 165.25,59.68 165.62,60.05 v166.26,60.05
  Route15 0.305: v166.26,60.05 169.24,60.05 169.94,60.75 174.35,60.75 177.16,57.94 192.63,57.94 194.15,56.42 v194.15,56.34
  Bottom 0.152: v194.15,56.34 v194.16,56.33 WIFI/BT.43
BT_UART_TXD  (via drill 0.3)
  Top 0.152: RPI_PINS1-100.55 164.45,58.71 v164.96,58.2
  Route15 0.305: v164.96,58.2 166.12,59.37 174.78,59.37 176.91,57.25 192.09,57.25 194.16,55.19 v195.04,55.19
  Bottom 0.152: v195.04,55.19 195.48,54.75 WIFI/BT.45
D+  (via drill 0.3)
  Top 0.152: v9.5,24.12 9.44,24.19 9.44,28.7 BAT_CHR.D+ | USB_PWR.D+_2 79.59,7.01 79.59,5.91 79.22,5.54 75.58,5.54 74.93,6.19 74.41,6.19 73.77,5.54 73.11,5.54 72.48,6.17 71.8,6.17 71.16,5.54 70.08,5.54 69.46,6.16 68.47,6.16 67.83,5.51 66.84,5.51 66.21,6.14 65.01,6.14 64.37,5.5 63.6,5.5 63.05,6.05 62.14,6.05 61.6,5.51 60.54,5.51 60.24,5.81 58.16,5.81 v57.6,5.25
  Bottom 0.152: v9.5,24.12 9.5,21.92 10.26,21.16 37.89,21.16 53.77,5.27 57.58,5.27 v57.6,5.25 | USB_PWR.D+ 80,7.9 USB_PWR.D+_2
D+1  (via drill 0.3)
  Top 0.152: USB_HUB.4 46.5,88 45.79,88.71 45.79,88.85 v45.77,88.86
  Bottom 0.152: v45.77,88.86 45.77,88.89 45.19,89.47 45.19,101.66 47.83,104.29 BOARD_CONN_1.10
D+2  (via drill 0.3)
  Top 0.152: USB_HUB.7 46.64,86.5 46.62,86.48 46.18,86.48 v45.7,86.96
  Bottom 0.152: BOARD_CONN_1.8 48.37,103.49 47.38,102.51 47.38,88.61 45.73,86.96 v45.7,86.96
D-  (via drill 0.3)
  Top 0.152: BAT_CHR.D- 9.93,28.71 9.93,24.88 v10.21,24.6 | v79.86,9.82 80.16,9.53 USB_PWR.D-_2 79.87,6.97 79.87,5.8 79.3,5.22 58.52,5.22 v58.45,5.29
  Bottom 0.152: v10.21,24.6 10.21,21.93 10.68,21.46 12.65,21.46 13.28,22.09 14.18,22.09 14.83,21.44 38.53,21.44 54.18,5.79 58.07,5.79 58.45,5.41 v58.45,5.29 | USB_PWR.D- 79.5,9.47 v79.86,9.82
D-1  (via drill 0.3)
  Top 0.152: USB_HUB.3 46.83,88.5 46.13,89.19 46.13,89.42 v46.16,89.44
  Bottom 0.152: BOARD_CONN_1.9 49.43,103.9 47.83,103.9 45.47,101.55 45.47,100.06 45.79,99.74 45.79,98.81 45.49,98.51 45.49,97.75 45.8,97.44 45.8,96.41 45.47,96.08 45.47,95.32 45.79,95 45.79,94.37 45.5,94.08 45.5,93.13 45.78,92.85 45.78,92.28 45.51,92.01 45.51,91.13 45.76,90.89 45.76,90.51 45.49,90.24 45.49,89.94 46,89.44 v46.16,89.44
D-2  (via drill 0.3)
  Top 0.152: USB_HUB.6 47.41,87 47.4,87.01 46.47,87.01 v46.42,86.96
  Bottom 0.152: BOARD_CONN_1.7 49.43,103.11 48.38,103.11 47.7,102.43 47.7,101.14 48.04,100.81 48.04,99.92 47.7,99.58 47.7,98.66 48.02,98.34 48.02,97.48 47.7,97.16 47.7,96.01 48,95.71 48,95.08 47.66,94.74 47.66,94.25 48.01,93.9 48.01,93.16 47.69,92.83 47.69,92.01 48,91.69 48,91.03 47.67,90.69 47.67,90.02 47.98,89.71 47.98,88.75 46.42,87.19 v46.42,86.96
DATA_IN  (via drill 0.3)
  Top 0.152: RPI_PINS1-100.25 170.45,58.38 v170.46,58.37 | v142.33,17.49 v142.33,17.48 v63.82,17.48 | TP19.TP 42.1,10.73 42.1,14.72 44.06,16.69 LEVEL_ADJ.A2 44.96,16.68 48.88,16.68 v48.9,16.66
  Bottom 0.152: v142.33,17.49 159.97,17.49 170,27.52 170,55.39 170.46,55.86 v170.46,58.37 | v142.33,17.49 | v63.82,17.48 49.71,17.48 v48.9,16.66
DEEM/CLKOUT
  Top 0.305: AUDIO_DAC.9 35.79,40.55 R12.C
DSEL
  Top 0.152: BAT_CHR.DSEL 7.66,29.47 6.05,27.86 R5.C
DSI1_C_N
  Top 0.152: RPI_PINS101-200.87 158.05,26.2 157.53,26.72 151.35,26.72 150.4,25.77 150.2,25.77 149.25,26.71 148.9,26.71 147.98,25.79 147.85,25.79 146.91,26.73 146.6,26.73 145.64,25.77 145.54,25.77 144.57,26.74 144.29,26.74 143.31,25.76 143.22,25.76 142.26,26.71 142,26.71 141.03,25.74 140.82,25.74 139.92,26.65 139.66,26.65 138.72,25.71 138.59,25.71 137.71,26.59 137.48,26.59 130.1,19.21 107.97,19.21 106.53,20.64 106.53,22.11 LCD_CONN.11
DSI1_C_P
  Top 0.152: RPI_PINS101-200.89 157.65,26.2 157.4,26.44 151.47,26.44 150.51,25.49 150.08,25.49 149.14,26.43 149.02,26.43 148.09,25.51 147.73,25.51 146.83,26.41 146.68,26.41 145.75,25.49 145.42,25.49 144.51,26.4 144.34,26.4 143.43,25.48 143.1,25.48 142.21,26.37 142.06,26.37 141.15,25.46 140.71,25.46 139.87,26.3 139.71,26.3 138.84,25.43 138.48,25.43 137.66,26.25 137.54,26.25 130.21,18.93 107.84,18.93 105.56,21.21 LCD_CONN.10
DSI1_D0_N  (via drill 0.3)
  Top 0.152: RPI_PINS101-200.75 160.45,24.63 160.02,24.2 137.65,24.2 133.78,20.32 v133.78,20.05 | LCD_CONN.8 103.47,22.04 v103.47,19.27
  Bottom 0.152: v103.47,19.27 103.82,19.62 133.07,19.62 133.49,20.05 v133.78,20.05
DSI1_D0_P  (via drill 0.3)
  Top 0.152: LCD_CONN.7 102.56,19.76 v102.81,19.51 | RPI_PINS101-200.77 160.05,24.62 159.9,24.48 137.5,24.48 133.53,20.5 133.51,20.51 133.32,20.51 v133.3,20.54
  Bottom 0.152: v102.81,19.51 103.2,19.9 132.95,19.9 133.29,20.24 133.29,20.25 133.32,20.28 133.32,20.51 v133.3,20.54
DSI1_D1_N
  Top 0.152: RPI_PINS101-200.81 159.25,27.05 158.36,27.95 137.19,27.95 129.82,20.58 129.51,20.58 128.26,21.83 127.84,21.83 126.59,20.59 126.41,20.59 125.21,21.79 124.75,21.79 123.58,20.63 123.38,20.63 122.25,21.76 121.88,21.76 120.78,20.67 120.62,20.67 119.56,21.73 119.16,21.73 117.77,20.34 114.8,20.34 114.38,20.76 114.38,21.45 114.07,21.76 113.1,21.76 112.8,21.46 112.8,20.74 112.42,20.36 109.71,20.36 109.53,20.55 109.53,22.1 LCD_CONN.14
DSI1_D1_P
  Top 0.152: RPI_PINS101-200.83 158.85,27.06 158.24,27.67 137.32,27.67 129.95,20.3 129.4,20.3 128.18,21.51 127.92,21.51 126.67,20.26 126.25,20.26 125.06,21.44 124.82,21.44 123.68,20.3 123.25,20.3 122.11,21.43 121.97,21.43 120.88,20.34 120.49,20.34 119.42,21.4 119.22,21.4 117.88,20.06 114.68,20.06 114.1,20.64 114.1,21.13 113.75,21.48 113.41,21.48 113.08,21.15 113.08,20.62 112.54,20.08 112.32,20.08 112.31,20.07 111.4,20.07 111.39,20.08 109.59,20.08 108.56,21.11 LCD_CONN.13
ETH0_N  (via drill 0.3)
  Top 0.152: RPI_PINS1-100.10 173.63,56.04 173.63,55.94 173.64,55.92 173.64,47.6 172.58,46.53 172.01,46.53 171.56,46.98 171.56,47.64 171.34,47.86 170.97,47.86 170.71,47.6 170.71,46.96 170.27,46.52 169.64,46.52 169.22,46.94 169.22,47.56 168.93,47.85 168.54,47.85 168.26,47.57 168.26,46.95 167.82,46.51 167.18,46.51 166.79,46.9 166.79,47.57 166.52,47.84 166.13,47.84 165.85,47.56 165.85,46.8 165.54,46.49 164.73,46.49 164.4,46.82 164.4,47.53 164.1,47.83 163.79,47.83 163.49,47.53 163.49,46.69 163.21,46.42 161.89,46.42 161.56,46.75 161.56,47.66 161.42,47.8 160.74,47.8 160.55,47.61 160.55,46.98 160.22,46.65 149.2,46.65 148.88,46.33 148.88,45.88 v149.05,45.71
  Bottom 0.152: BOARD_CONN_1.22 51.95,103.14 52.52,103.14 52.69,103.32 53.17,103.32 53.25,103.24 57.55,103.24 57.65,103.14 57.65,30.92 58.84,29.73 131.01,29.73 135.56,34.29 148.36,34.29 148.84,34.76 148.84,45.5 v149.05,45.71
ETH0_P  (via drill 0.3)
  Top 0.152: RPI_PINS1-100.12 173.25,47.6 172.46,46.81 172.13,46.81 171.84,47.1 171.84,47.75 171.46,48.14 170.74,48.14 170.43,47.82 170.43,47.08 170.15,46.8 169.76,46.8 169.5,47.06 169.5,47.8 169.18,48.13 168.29,48.13 167.98,47.81 167.98,47.07 167.7,46.79 167.3,46.79 167.07,47.02 167.07,47.8 166.76,48.12 165.88,48.12 165.57,47.8 165.57,46.92 165.42,46.77 164.85,46.77 164.68,46.94 164.68,47.77 164.35,48.11 163.52,48.11 163.21,47.79 163.21,46.84 163.07,46.7 162.02,46.7 161.84,46.88 161.84,47.77 161.54,48.08 160.62,48.08 160.27,47.72 160.27,47.1 160.1,46.93 149.09,46.93 148.55,46.39 148.55,45.9 v148.37,45.72 v148.36,45.72
  Bottom 0.152: BOARD_CONN_1.23 51.93,103.49 51.95,103.52 52.5,103.52 52.58,103.6 53.29,103.6 53.37,103.52 57.67,103.52 57.93,103.26 57.93,31.04 58.96,30.01 130.89,30.01 135.45,34.57 148.25,34.57 148.56,34.88 148.56,45.59 148.56,45.58 148.42,45.72 v148.36,45.72
ETH1_N  (via drill 0.3)
  Top 0.152: RPI_PINS1-100.6 174.45,46.27 172.81,44.63 172.7,44.63 171.77,45.56 171.47,45.56 170.5,44.59 170.39,44.59 169.37,45.61 169.08,45.61 168.05,44.59 167.97,44.59 167,45.56 166.65,45.56 165.69,44.6 165.61,44.6 164.69,45.52 164.4,45.52 163.43,44.56 163.4,44.56 162.44,45.52 162.15,45.52 161.22,44.6 161.1,44.6 160.16,45.54 159.98,45.54 159.04,44.61 158.9,44.61 157.91,45.59 157.73,45.59 156.66,44.53 156.44,44.53 155.36,45.61 155.17,45.61 154.1,44.54 153.78,44.54 152.52,45.8 v150.18,45.8 | v56.99,102.36 v56.98,102.36 56.87,102.25 55.99,102.25 55.92,102.32 53.09,102.32 52.96,102.19 52.93,102.19 v52.93,102.14
  Bottom 0.152: v150.18,45.8 v150.17,45.79 150.17,45.57 149.75,45.15 149.75,33.86 149.37,33.48 136.14,33.48 131.47,28.81 58.38,28.81 56.78,30.41 56.78,102.17 v56.98,102.37 v56.99,102.36 | BOARD_CONN_1.20 51.92,102.29 52.83,102.29 52.93,102.2 v52.93,102.14
ETH1_P  (via drill 0.3)
  Top 0.152: RPI_PINS1-100.4 174.85,46.27 172.93,44.35 172.58,44.35 171.65,45.28 171.58,45.28 170.61,44.31 170.27,44.31 169.25,45.33 169.19,45.33 168.17,44.31 167.86,44.31 166.88,45.28 166.76,45.28 165.8,44.32 165.49,44.32 164.6,45.21 164.48,45.21 163.55,44.28 163.29,44.28 162.34,45.22 162.24,45.22 161.34,44.32 160.99,44.32 160.13,45.17 160,45.17 159.16,44.33 158.79,44.33 157.89,45.22 157.75,45.22 156.78,44.25 156.32,44.25 155.35,45.22 155.18,45.22 154.22,44.26 153.67,44.26 152.55,45.38 150.65,45.38 v150.33,45.06 v150.34,45.05 | v56.35,102.75 v56.35,102.74 56.2,102.6 53.15,102.6 52.94,102.81 v52.94,102.83
  Bottom 0.152: BOARD_CONN_1.21 51.94,102.66 52.72,102.66 52.73,102.67 52.76,102.67 52.91,102.83 v52.94,102.83 | v56.35,102.75 56.5,102.61 56.5,30.3 58.26,28.53 131.59,28.53 136.26,33.2 149.49,33.2 150.03,33.74 150.03,44.76 v150.33,45.06 v150.34,45.05
ETH2_N  (via drill 0.3)
  Top 0.152: RPI_PINS1-100.9 173.66,59.13 173.66,58.01 173.72,57.95 175.72,57.95 175.99,57.68 175.99,45.88 173.36,43.24 173.27,43.24 173.26,43.23 153.14,43.23 152.31,44.07 151.57,44.07 151.32,43.82 151.32,42.97 v151.51,42.78
  Bottom 0.152: v151.51,42.78 151.3,42.56 151.3,32.89 150.29,31.88 136.57,31.88 132.21,27.52 57.61,27.52 55.51,29.62 55.51,101.35 55.42,101.44 53.31,101.44 53.24,101.38 52.61,101.38 52.51,101.47 51.92,101.47 BOARD_CONN_1.18
ETH2_P  (via drill 0.3)
  Top 0.152: RPI_PINS1-100.11 173.26,59.13 173.26,58.01 173.6,57.67 175.6,57.67 175.71,57.56 175.71,45.99 173.24,43.52 153.25,43.52 152.26,44.51 151.32,44.51 151.02,44.2 151.02,42.93 150.88,42.78 v150.82,42.78
  Bottom 0.152: BOARD_CONN_1.19 52.48,101.9 52.73,101.66 53.13,101.66 53.19,101.72 55.54,101.72 55.79,101.47 55.79,29.74 57.73,27.8 132.09,27.8 136.45,32.16 150.17,32.16 151.02,33.01 151.02,42.64 150.88,42.78 v150.82,42.78
ETH3_N  (via drill 0.3)
  Top 0.152: RPI_PINS1-100.5 174.55,59.15 174.55,59.57 174.57,59.6 174.57,59.68 174.91,60.02 175,60.02 175.01,60.03 176,60.03 177.07,58.96 177.07,45.37 173.87,42.17 153.36,42.17 152.74,41.55 v152.74,41.53
  Bottom 0.152: BOARD_CONN_1.16 51.91,100.7 52.51,100.7 54.54,98.68 54.54,29.16 57.25,26.45 133.02,26.45 137.22,30.65 150.79,30.65 152.45,32.31 152.45,41.25 v152.73,41.53 v152.74,41.53
ETH3_P  (via drill 0.3)
  Top 0.152: v152.46,42.3 152.61,42.45 173.76,42.45 176.79,45.49 176.79,58.73 175.78,59.74 175.03,59.74 174.85,59.56 RPI_PINS1-100.3
  Bottom 0.152: BOARD_CONN_1.17 52.02,101.09 53.95,101.09 54.82,100.22 54.82,29.28 57.33,26.77 132.8,26.77 136.99,30.96 150.67,30.96 152.17,32.46 152.17,41.52 151.97,41.73 151.97,42.06 152.26,42.35 152.41,42.35 v152.46,42.3
ETH_LEDG  (via drill 0.3)
  Top 0.152: RPI_PINS1-100.15 172.45,58.51 v172.6,58.36 | v154.31,30.18 | v172.65,31.31 | v172.65,31.31 172.54,31.2 155.33,31.2 v154.31,30.18
  Route2 0.254: v55.38,104.01 56.98,104.01 57.69,103.3 57.69,25.85 63.16,20.38 v63.16,20.17
  Bottom 0.152: v172.6,58.36 172.47,58.23 172.47,31.48 v172.65,31.31 | v63.16,20.17 63.23,20.1 97.39,20.1 99.94,17.54 134.09,17.54 143.65,27.09 151.22,27.09 v154.31,30.18 | BOARD_CONN_1.24 52.48,103.89 52.5,103.92 53.36,103.92 53.39,103.89 55.29,103.89 55.38,103.98 v55.38,104.01
ETH_LEDY  (via drill 0.3)
  Top 0.152: RPI_PINS1-100.17 172.05,58.52 v171.9,58.37 | v171.95,31.7 155,31.7 v153.51,30.21 v153.51,30.2
  Route2 0.254: v54.75,104.39 54.77,104.37 54.9,104.37 55.12,104.59 56.95,104.59 58.07,103.47 58.07,26.23 v63.59,20.7
  Bottom 0.152: v171.9,58.37 172.05,58.21 172.05,31.79 v171.95,31.7 | v54.75,104.39 54.65,104.29 BOARD_CONN_1.25 | v63.59,20.7 63.88,20.42 97.46,20.42 100.06,17.82 133.98,17.82 143.53,27.37 150.68,27.37 v153.51,30.2
FB
  Top 0.254: R36.C R46.A 15.82,60.72 14.74,59.65 5V_REG.FB
GAIN1  (via drill 0.3)
  Top 0.152: v31.39,62.48 AUDIO_AMP.P$5 | R47.A R48.A R49.A 40.42,28.83 R50.A 42.25,28.85 42.25,30.76 39.53,33.47 39.53,58.52 v35.68,62.37
  Bottom 0.152: v35.68,62.37 31.5,62.37 v31.39,62.48
GLOBAL_EN
  Top 0.152: RPI_PINS1-100.99 155.65,59.77 156.09,60.21 164.61,60.21 167.67,63.27 179.65,63.27 193.55,77.17 193.55,90.42 187.51,96.46 183.74,96.46 TP12.TP 182.65,97.65 182.65,97.94 184.12,99.42 187.14,99.42 187.4,99.68 187.4,104.53 188.85,105.98 TR4.D
GND  (via drill 0.3)
  Top 0.152: BAT_CHR.PWRPAD v10.17,31.62 | USB_HUB.37 49.06,88.56 v49.06,88.61 | USB_SWI./OE 181.08,75.58 USB_POE.GND_1 USB_POE.GND_2 | R50.C 42.21,27.11 R34.A
  Top 0.2: 30.53,66.38 AUDIO_AMP.P$THERMAL 31.53,66.38 32.18,67.02 AUDIO_AMP.P$8 | 30.53,66.38 29.78,65.63 AUDIO_AMP.P$1 | 30.58,66.42 30.53,66.38
  Top 0.203: 26.48,66.42 C38.A
  Top 0.254: 5V_REG.LBI 16.04,54.12 5V_REG.PWRPAD | 5V_REG.SYNC 16.69,55.19 16.14,55.75 5V_REG.PWRPAD | 5V_REG.GND 15.39,56.72 5V_REG.PWRPAD | 5V_REG.LBO 16.04,57.37 5V_REG.PWRPAD | TR5.S TR6.S 182.97,110.15 R15.A | CLK_24M.GND_2 54.74,93.68 C53.A | R12.A R13.A R10.A R11.A R9.A R8.A | C17.A C41.A | C42.A C18.A | C18.A | R28.A 48.83,95.57 C52.A 48.91,95.58 CLK_24M.GND_1 | C21.A 43.52,98.69 C1.A | C20.A 40.22,91.34 R27.C | R33.C 57.07,87.02 R30.C R31.C | C43.A C19.A | C11.A C35.A | R24.C 179.02,67.25 C18.A | C57.C C48.A | 3.3V-1.8V_REG.GND2 13.21,70.84 3.3V-1.8V_REG.PWRPAD 12.76,70.39 3.3V-1.8V_REG.GND1 | C7.A 18,66.46 18.64,65.81 18.64,64.08 C50.C
  Top 0.305: FB2.2 37.76,40.48 R12.A | 30.58,66.42 26.48,66.42
  Top 0.508: TR1.S 16.3,82.6 R6.A | TR2.S 22.73,82.6 R7.A | C2.A 13.99,33.79 R29.A
  Top 0.813: v12.7,54.81 12.7,55.32 12.35,55.67 11.07,55.67 11.07,60.22 10.83,60.46 10.83,60.86 C51.A | C38.A C14.A
  Top 1.27: C5.A C30.A 16.82,49.12 17.84,49.12 19.12,50.4 19.12,60.93 R36.A 19.13,62.16 18.58,62.71 C50.C | v28.19,66.38 AUDIO_AMP.P$THERMAL v34.06,66.38 | C3.A 14.26,36.95 C4.A 14.26,41.61 13.52,42.34 11.32,42.34 BAT_CONN.2
  Route2 0.254: 76.36,8.05 USB_PWR.MP_3 73.82,8.05 | 82.84,8.05 USB_PWR.MP_4 85.79,8.05 | 95.15,5.82 HDMI_CONN.MP_3 97.39,5.82 | 94.77,1.32 HDMI_CONN.MP_4 97.86,1.32 | 105.97,5.82 HDMI_CONN.MP_1 108.8,5.82 | 108.88,1.32 HDMI_CONN.MP_2 105.92,1.32 | 183.88,79.39 USB_IN.MP_1 186.38,79.39 | 191.06,79.39 USB_IN.MP_2 193.76,79.39
  Route15 0.254: 186.48,79.39 USB_IN.MP_1 183.6,79.39 | 191.24,79.39 USB_IN.MP_2 193.9,79.39 | 108.87,5.82 HDMI_CONN.MP_1 106.16,5.82 | 108.95,1.32 HDMI_CONN.MP_2 105.97,1.32 | 98.26,1.32 HDMI_CONN.MP_4 94.91,1.32 | 97.73,5.82 HDMI_CONN.MP_3 94.78,5.82 | 85.75,8.05 USB_PWR.MP_4 82.83,8.05 | 76.67,8.05 USB_PWR.MP_3 73.74,8.05
  Bottom 0.152: BOARD_CONN_1.30
  Bottom 0.254: MICROSD.VSS 127.79,1.41 128,1.2 130.8,1.2 131.1,1.5 131.1,2.62 MICROSD.MP_2
  Bottom 0.305: USB_PWR.MP_3 76.14,8.05 76.7,7.49 USB_PWR.GND_3 | USB_PWR.MP_4 83.38,8.05 82.81,7.47 USB_PWR.GND_4
  other vias: 9.06,34.56 9.06,35.37 9.06,36.19 9.06,37 11.06,31.62 11.06,30.75 11.06,29.87 10.19,29.87 9.31,30.75 10.19,30.75 9.06,37.81 12.7,56.69 13.83,56.69 13.83,54.81 15.08,56.69 15.08,54.81 16.2,56.69 16.2,54.81 9.31,31.63 9.3,29.86 34.06,64.81 34.06,68 28.19,64.81 28.19,67.93 51.23,88.61 50.11,88.6 49.06,87.51 51.23,87.51 50.11,87.5 49.06,86.41 51.23,86.41 50.11,86.4 185.2,108.3 34.81,117.12 198.77,99.99 205.01,26.26 23.52,117.11 32.24,110.85 14.31,112.67 48,112 11.5,98 11.5,92 23.41,95.03 3.5,77.5 3.5,72.5 11.55,82.79 3.19,61.43 25.49,69.95 25.5,76 20.47,74.33 21.08,55.36 21.08,60.13 8.05,55.55 3.65,55.55 3.5,43.58 15.23,46.35 37.7,30.88 27.47,34.21 24.1,25.2 51.76,12.17 49.5,75 49.5,70 51,98 38.5,92.5 38.5,82 88.5,11 101,19.5 116,10.5 126,10.5 169.5,9 169.5,16 162,27.5 173,27.5 151.5,58.5 151.52,52.24 149,25.25 202,26.25 202,23 184.03,27.51 172.8,65.66 198.84,96.82 47.43,9 36,9 200.19,85.23 133.13,34.01 18.18,95.06 31.44,37.62 17.6,29.84 16.3,27.04 13.5,27.04 3.49,37.61 6.7,24.14 3.5,33.14 1.8,24.14 153.4,13.94 156.6,13.94 193.28,104.41 193.38,96.81 197.07,99.99 51.26,20.25 13.84,71.01 13.84,70.21 12.99,70.21 12.99,71.01 12.12,71.01 12.12,70.21 16.64,68.56 15.77,68.56 9.84,72.51 9.09,72.51 9.09,60.29 56.13,15.2 21.02,49.19 17.48,68.57 88.5,19.2 116.53,25.83 38.95,34.63 38.96,37.92 116.54,20.91 197.12,46.2 191.26,46.17 191.26,48.69 167.2,60.99 197.11,48.74 185.86,53.38 172.85,60.1 174.37,57.16 191.43,55.04 189.6,55.03 169.47,54.25 167.9,56.82 16.71,33.87 174.72,36.05 168.67,35.99 153.22,33.41 144.42,25.25 135.22,20.38 139.95,9.97 121.03,3.58 132.59,6.77 135.48,3.42 1.84,33.13 182.55,94.29 180.9,87.19
  pour Top (rank 2): -6.98,123.56 -6.98,-5.15 -4.75,-7.39 216.49,-7.39 219.66,-4.22 219.66,115.89 210.14,125.41 -5.98,125.41 -6.93,124.46
  pour Route2: -3.78,129.67 -9.19,124.27 -9.19,-6.21 -4.94,-10.46 218.09,-10.46 223.22,-5.32 223.22,117.95 211.5,129.67
  pour Route15: -3.46,134.96 -13.93,124.49 -13.93,-4.76 -4.61,-14.08 218.65,-14.08 227.44,-5.29 227.44,119.23 211.71,134.96
  pour Bottom (rank 2): -5.78,137.95 -18.9,124.84 -18.9,-4.18 -7.02,-16.06 220.17,-16.06 232.05,-4.18 232.05,119.03 213.13,137.95
  cutout Route2: 75.26,9.36 arc90 74.46,8.57 74.46,7.53 arc90 75.23,6.76 arc90 76.06,7.58 76.06,8.59 arc90 75.28,9.36
  cutout Bottom: 182.5,93.45 arc-90 184.87,91.07 arc-90 182.59,88.79 arc-90 180.21,91.16 arc-90
  cutout Route15: 182.49,93.42 arc-90 184.86,91.04 arc-90 182.58,88.76 arc-90 180.2,91.13 arc-90
  cutout Route2: 182.49,93.43 arc-90 184.87,91.05 arc-90 182.58,88.77 arc-90 180.21,91.14 arc-90
  cutout Top: 182.5,93.42 arc-90 184.87,91.05 arc-90 182.58,88.76 arc-90 180.21,91.14 arc-90
  cutout Bottom: 143.89,59.43 arc-90 146.27,57.05 arc-90 143.98,54.77 arc-90 141.61,57.14 arc-90
  cutout Route15: 143.88,59.4 arc-90 146.26,57.02 arc-90 143.97,54.74 arc-90 141.6,57.11 arc-90
  pour Top (no thermals): 8.89,32.38 8.64,32.62 8.64,38.21 9.51,38.21 9.51,32.38
  cutout Top: 8.63,32.31 8.63,29.28 8.68,29.24 11.55,29.24 11.7,29.38 11.7,32.04 11.48,32.26 11.41,32.32 9.64,32.32
  pour Top (no thermals): 13.33,52.12 13.33,55.38 14.89,55.38 14.89,52.14 13.35,52.14 13.35,52.16
  pour Top (no thermals): 10.19,57.38 19.6,57.38 19.6,54.42 19.6,54.15 10.25,54.15 10.19,54.15 10.19,57.15
  cutout Top: 9.98,52.09 17.19,52.09 17.19,51.46 10.02,51.46 10.02,52.03
  cutout Top: 11.64,57.52 11.64,60.27 12.47,60.27 12.47,57.52 11.78,57.52 11.78,57.54
  cutout Top: 12.96,54.09 12.96,53.52 9.89,53.52 9.89,54.07 12.8,54.07
  cutout Top: 16.26,59.34 15.13,59.34 15.13,59.65 15.73,60.24 16.29,60.24
  pour Top (no thermals): 7.67,71.62 7.67,69.71 18.38,69.71 18.38,71.64 7.79,71.64
  pour Bottom (no thermals): 51.6,106.33 51.6,104.65 52.97,104.65 52.97,106.33
  cutout Bottom: 49.83,106.85 49.83,100.16 50.15,100.16 50.15,106.86 49.9,106.86
GND1
  cutout Bottom: 51.21,106.85 51.21,100.17 51.52,100.17 51.52,106.87 51.35,106.87
GND4
  cutout Top: 15.76,110.83 arc-90 18.13,108.46 arc-90 15.85,106.17 arc-90 13.47,108.55 arc-90
GND6
  cutout Route2: 15.75,110.84 arc-90 18.13,108.46 arc-90 15.84,106.18 arc-90 13.47,108.55 arc-90
GND7
  cutout Route15: 15.75,110.83 arc-90 18.12,108.45 arc-90 15.84,106.17 arc-90 13.47,108.54 arc-90
GND8
  cutout Bottom: 15.76,110.86 arc-90 18.13,108.48 arc-90 15.85,106.2 arc-90 13.47,108.57 arc-90
GND9
  cutout Top: 40.26,110.83 arc-90 42.63,108.46 arc-90 40.34,106.17 arc-90 37.97,108.55 arc-90
GND10
  cutout Route2: 40.25,110.84 arc-90 42.63,108.46 arc-90 40.34,106.18 arc-90 37.97,108.55 arc-90
GND11
  cutout Route15: 40.25,110.83 arc-90 42.62,108.45 arc-90 40.34,106.17 arc-90 37.96,108.54 arc-90
GND12
  cutout Bottom: 40.26,110.86 arc-90 42.63,108.48 arc-90 40.35,106.2 arc-90 37.97,108.57 arc-90
GND13
  cutout Top: 19.27,47.58 arc-90 21.64,45.21 arc-90 19.36,42.93 arc-90 16.99,45.3 arc-90
GND14
  cutout Route2: 19.27,47.59 arc-90 21.64,45.21 arc-90 19.36,42.93 arc-90 16.98,45.3 arc-90
GND15
  cutout Route15: 19.26,47.58 arc-90 21.64,45.2 arc-90 19.35,42.92 arc-90 16.98,45.29 arc-90
GND16
  cutout Bottom: 19.27,47.61 arc-90 21.65,45.23 arc-90 19.36,42.95 arc-90 16.99,45.32 arc-90
GND17
  cutout Top: 55.04,11.53 arc-90 57.41,9.15 arc-90 55.13,6.87 arc-90 52.76,9.24 arc-90
GND18
  cutout Route2: 55.04,11.53 arc-90 57.41,9.16 arc-90 55.12,6.87 arc-90 52.75,9.24 arc-90
GND19
  cutout Route15: 55.03,11.52 arc-90 57.41,9.15 arc-90 55.12,6.86 arc-90 52.75,9.24 arc-90
GND20
  cutout Bottom: 55.04,11.55 arc-90 57.42,9.18 arc-90 55.13,6.89 arc-90 52.76,9.27 arc-90
GND21
  cutout Top: 136.05,11.56 arc-90 138.43,9.19 arc-90 136.14,6.9 arc-90 133.77,9.28 arc-90
GND22
  cutout Route2: 136.05,11.56 arc-90 138.42,9.19 arc-90 136.14,6.91 arc-90 133.76,9.28 arc-90
GND23
  cutout Route15: 136.04,11.56 arc-90 138.42,9.18 arc-90 136.13,6.9 arc-90 133.76,9.27 arc-90
GND24
  cutout Bottom: 136.05,11.59 arc-90 138.43,9.21 arc-90 136.14,6.93 arc-90 133.77,9.3 arc-90
GND25
  cutout Top: 191.89,26.5 arc-90 194.26,24.12 arc-90 191.98,21.84 arc-90 189.6,24.21 arc-90
GND26
  cutout Route2: 191.88,26.5 arc-90 194.26,24.13 arc-90 191.97,21.84 arc-90 189.6,24.22 arc-90
GND27
  cutout Route15: 191.88,26.49 arc-90 194.26,24.12 arc-90 191.97,21.83 arc-90 189.6,24.21 arc-90
GND28
  cutout Bottom: 191.89,26.52 arc-90 194.26,24.15 arc-90 191.98,21.86 arc-90 189.61,24.24 arc-90
GND29
  cutout Top: 143.89,59.4 arc-90 146.26,57.03 arc-90 143.98,54.75 arc-90 141.61,57.12 arc-90
GND30
  cutout Route2: 143.89,59.41 arc-90 146.26,57.03 arc-90 143.98,54.75 arc-90 141.6,57.12 arc-90
GND31
  cutout Route15: 75.26,9.37 arc90 74.47,8.57 74.47,7.53 arc90 75.23,6.76 arc90 76.06,7.58 76.06,8.59 arc90 75.28,9.37
GND33
  cutout Route2: 84.26,9.35 arc90 83.47,8.56 83.47,7.51 arc90 84.24,6.75 arc90 85.06,7.57 85.06,8.58 arc90 84.29,9.35
GND34
  cutout Route15: 84.26,9.35 arc90 83.47,8.55 83.47,7.51 arc90 84.23,6.74 arc90 85.06,7.56 85.06,8.57 arc90 84.28,9.35
GND35
  cutout Route2: 96.43,7.12 arc90 95.64,6.32 95.64,5.28 arc90 96.41,4.51 arc90 97.23,5.33 97.23,6.34 arc90 96.46,7.12
GND36
  cutout Route15: 96.43,7.11 arc90 95.64,6.32 95.64,5.27 arc90 96.41,4.5 arc90 97.23,5.33 97.23,6.33 arc90 96.45,7.11
GND37
  cutout Route2: 96.43,2.63 arc90 95.64,1.84 95.64,0.79 arc90 96.41,0.03 arc90 97.23,0.85 97.23,1.86 arc90 96.46,2.63
GND38
  cutout Route15: 96.43,2.62 arc90 95.64,1.83 95.64,0.79 arc90 96.41,0.02 arc90 97.23,0.84 97.23,1.85 arc90 96.45,2.62
GND39
  cutout Route2: 107.27,2.63 arc90 106.48,1.84 106.48,0.79 arc90 107.25,0.03 arc90 108.07,0.85 108.07,1.86 arc90 107.3,2.63
GND40
  cutout Route15: 107.27,2.62 arc90 106.48,1.83 106.48,0.79 arc90 107.25,0.02 arc90 108.07,0.84 108.07,1.85 arc90 107.3,2.62
GND41
  cutout Route2: 107.27,7.12 arc90 106.48,6.32 106.48,5.28 arc90 107.25,4.51 arc90 108.07,5.33 108.07,6.34 arc90 107.3,7.12
GND42
  cutout Route15: 107.27,7.11 arc90 106.48,6.32 106.48,5.27 arc90 107.25,4.5 arc90 108.07,5.33 108.07,6.33 arc90 107.3,7.11
GND43
  cutout Route2: 185.15,80.68 arc90 184.35,79.89 184.35,78.84 arc90 185.12,78.08 arc90 185.94,78.9 185.94,79.91 arc90 185.17,80.68
GND44
  cutout Route15: 185.14,80.67 arc90 184.35,79.88 184.35,78.83 arc90 185.12,78.07 arc90 185.94,78.89 185.94,79.9 arc90 185.17,80.67
GND45
  cutout Route2: 192.29,80.69 arc90 191.5,79.9 191.5,78.85 arc90 192.27,78.09 arc90 193.09,78.91 193.09,79.92 arc90 192.32,80.69
GND46
  cutout Route15: 192.29,80.68 arc90 191.5,79.89 191.5,78.85 arc90 192.27,78.08 arc90 193.09,78.9 193.09,79.91 arc90 192.32,80.68
GPIO7
  Top 0.152: TR5.D 188.89,111 189.68,110.21 189.68,106.41 187.68,104.41 187.68,98.68 TP11.TP 186.77,97.6 193.83,90.54 193.83,77.06 179.76,62.99 169.4,62.99 168.05,61.64 RPI_PINS1-100.37
GPIO8  (via drill 0.3)
  Top 0.152: RPI_PINS1-100.39 167.66,58.6 v167.88,58.38 | BUT_MISC.2 43.13,117.13 v37.88,111.89 | v165.85,37.82 165.64,37.62 142.26,37.62 133.38,28.74 56.24,28.74 v47.48,37.5
  Route2 0.254: v47.48,37.5 46.79,38.19 46.79,78.51 37.73,87.57 37.73,111.74 v37.88,111.89
  Bottom 0.152: v165.85,37.82 165.85,55.12 167.35,56.63 167.35,57.85 v167.88,58.38
GPIO9  (via drill 0.3)
  Top 0.152: BUT_VOL_UP.2 15.59,113.89 16.52,112.96 35.84,112.96 v36.23,112.57 | v45.95,37.32 46.16,37.32 55.3,28.18 133.61,28.18 142.49,37.06 166.93,37.06 v167.67,37.8 | RPI_PINS1-100.40 167.65,54.93 v167.62,54.9
  Route2 0.254: v36.23,112.57 36.26,112.54 36.26,87.95 46.03,78.18 46.03,37.46 45.89,37.32 v45.95,37.32
  Bottom 0.152: v167.67,37.8 167.62,37.85 v167.62,54.9
GPIO10  (via drill 0.3)
  Top 0.152: RPI_PINS1-100.44 166.83,56.04 166.83,54.99 v166.93,54.89 | v46.72,37.45 55.71,28.46 133.5,28.46 142.38,37.34 166.36,37.34 v166.82,37.8 | BUT_VOL_DOWN.2 32.59,117.13 37.07,112.66 37.07,112.27 v37.08,112.26
  Route2 0.254: v46.72,37.45 v46.71,37.45 46.41,37.75 46.41,78.34 37.05,87.7 37.05,112.23 v37.08,112.26
  Bottom 0.152: v166.82,37.8 166.82,54.78 v166.93,54.89
GPIO11  (via drill 0.3, 0.35)
  Top 0.152: R51.C 36.72,19.29 LEVEL_ADJ.OE 41.95,19.29 43.76,21.09 v46.16,21.09 | v168.44,37.81 167.42,36.78 142.62,36.78 133.73,27.9 v54.81,27.9 | RPI_PINS1-100.38 168.05,55.15 v168.31,54.89
  Route2 0.254: v49.36,21.55 v49.37,21.55
  Route2 0.305: v49.37,21.55 54.81,27 v54.81,27.9
  Bottom 0.152: v46.16,21.09 48.9,21.09 v49.36,21.55 | v168.44,37.81 168.31,37.94 v168.31,54.89
GPIO12  (via drill 0.3)
  Top 0.152: RPI_PINS1-100.31 169.25,60.07 169.91,60.73 v181.64,60.73 v181.65,60.73 | R19.C 200.29,59.49 TR3.G | R19.C 200.29,56.06 TP16.TP | R19.C 200.24,57.84 v196.83,57.84
  Bottom 0.152: v196.83,57.84 v196.82,57.84 193.91,60.74 181.67,60.74 v181.65,60.73
HDMI0_CEC  (via drill 0.3)
  Top 0.152: v165.4,24.27 165.25,24.42 RPI_PINS101-200.51 | v154.03,19.32 154.03,18.87 148.97,13.8 142.76,13.8 141.4,12.44 104.5,12.44 v103.45,11.39
  Bottom 0.152: v165.4,24.27 160.32,19.18 154.22,19.18 154.09,19.32 v154.03,19.32 | v103.45,11.39 HDMI_CONN.14
HDMI0_CK_N  (via drill 0.3)